# EAGLE design robot (EAGLE 6.3)

## Sheet 1 of 17: PIC32
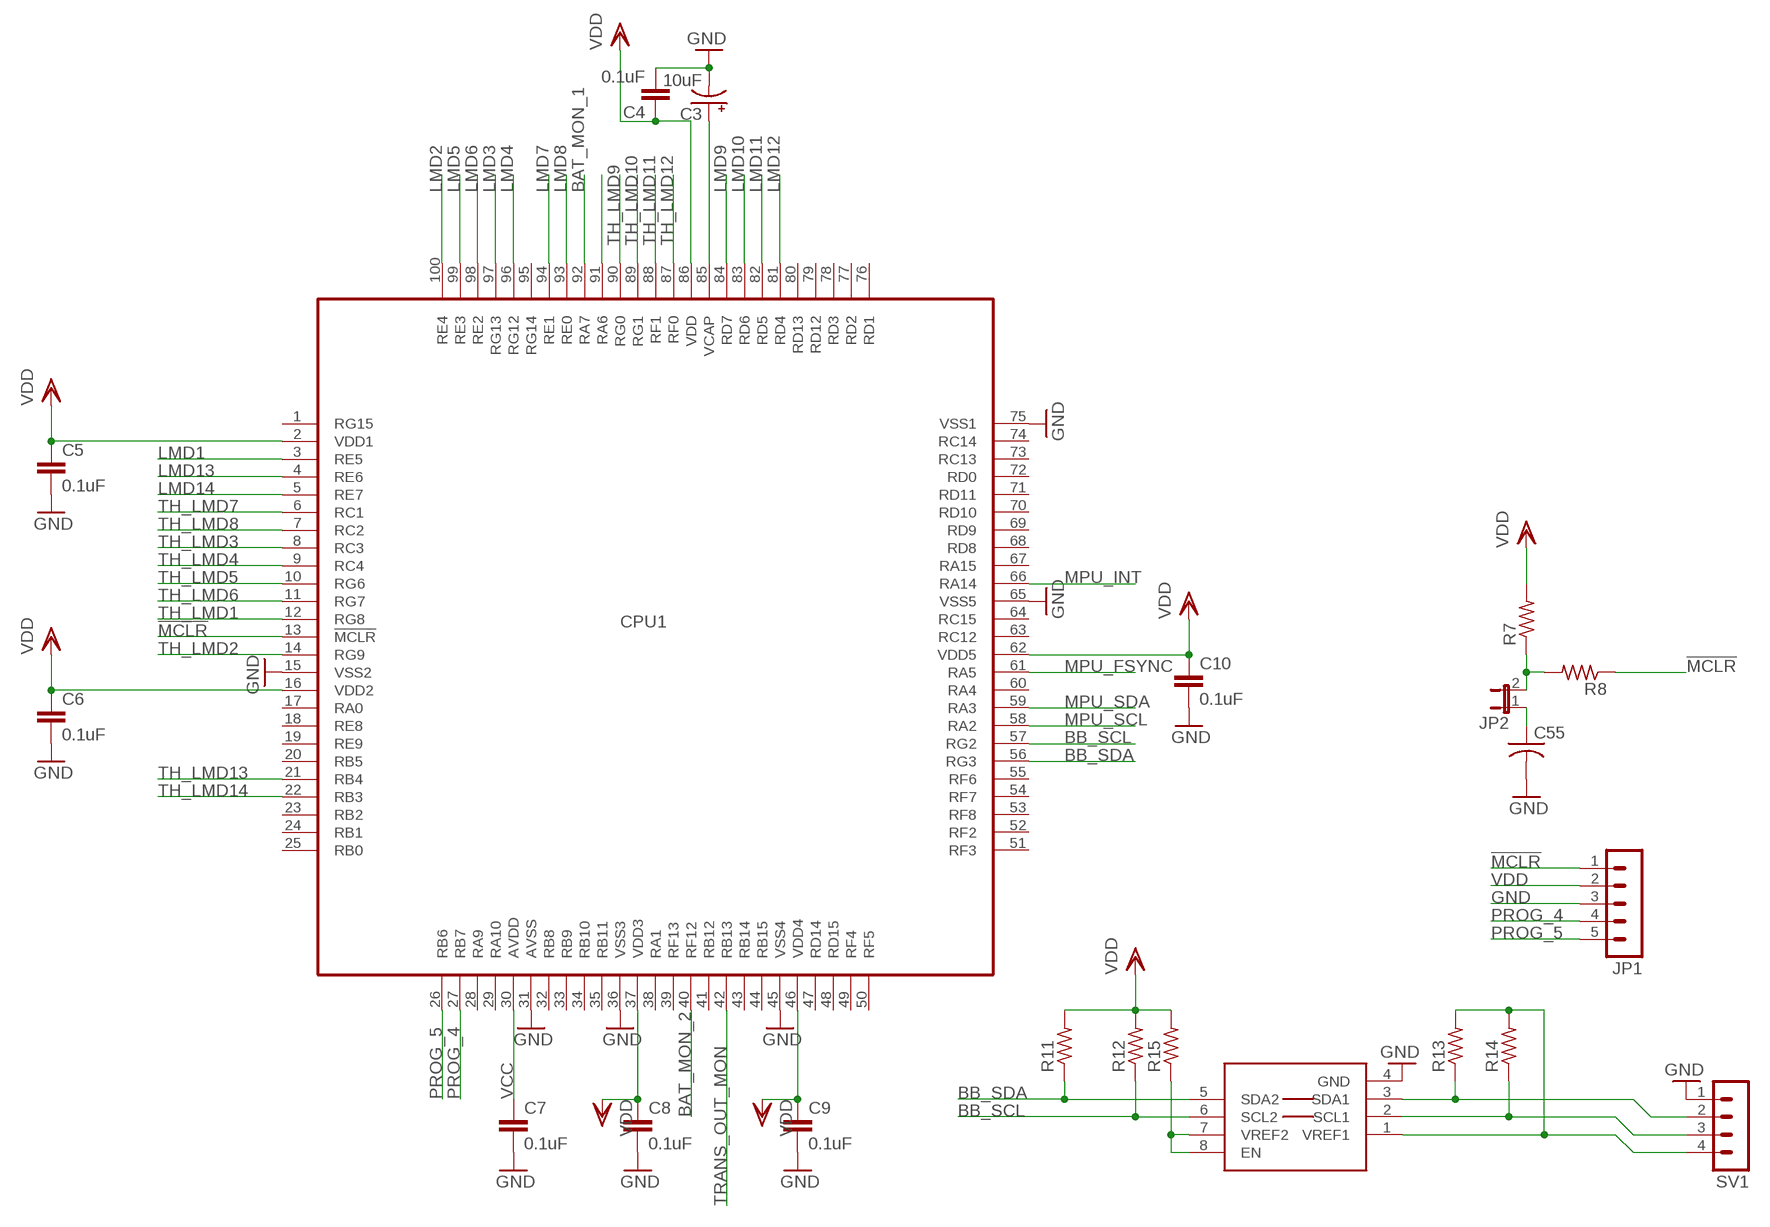
[diagram p0: schematic, sheet 1]

### Parts
C3  10uF  10UF-TANT  [EIA3216]
C4  0.1uF  0.1UF-25V(+80/-20%)(0603)  [0402-CAP]
C5  0.1uF  0.1UF-25V(+80/-20%)(0603)  [0402-CAP]
C6  0.1uF  0.1UF-25V(+80/-20%)(0603)  [0402-CAP]
C7  0.1uF  0.1UF-25V(+80/-20%)(0603)  [0402-CAP]
C8  0.1uF  0.1UF-25V(+80/-20%)(0603)  [0402-CAP]
C9  0.1uF  0.1UF-25V(+80/-20%)(0603)  [0402-CAP]
C10  0.1uF  0.1UF-25V(+80/-20%)(0603)  [0402-CAP]
C55  C-USC0603  [C0603]
CPU1  DSPIC33FJ32GS610TQFP  [TQFP100-14X14]
JP1  MA05-1  [MA05-1]
JP2  JP1E  [JP1]
R7  R-US_R0603  [R0603]
R8  R-US_R0603  [R0603]
R11  R-US_R0603  [R0603]
R12  R-US_R0603  [R0603]
R13  R-US_R0603  [R0603]
R14  R-US_R0603  [R0603]
R15  R-US_R0603  [R0603]
SV1  MA04-1  [MA04-1]
U$17  PCA9306  [PSOP-8]

### Nets
!MCLR: CPU1.13(!MCLR) JP1.1 R8.1
BAT_MON_1: CPU1.92(RA7) ; also sheet 17
BAT_MON_2: CPU1.40(RF12) ; also sheet 17
BB_SCL: CPU1.57(RG2) R12.1 U$17.6(SCL2)
BB_SDA: CPU1.56(RG3) R11.1 U$17.5(SDA2)
GND: C3.C(-) C4.2 C5.2 C6.2 C7.2 C8.2 C9.2 C10.2 C55.2 CPU1.15(VSS2) CPU1.31(AVSS) CPU1.36(VSS3) CPU1.45(VSS4) CPU1.65(VSS5) CPU1.75(VSS1) JP1.3 SV1.1 U$17.4(GND) ; also sheet 2,3,4,5,6,7,8,9,10,11,12,13,14,15,16,17
LMD1: CPU1.3(RE5) ; also sheet 3
LMD2: CPU1.100(RE4) ; also sheet 4
LMD3: CPU1.97(RG13) ; also sheet 5
LMD4: CPU1.96(RG12) ; also sheet 6
LMD5: CPU1.99(RE3) ; also sheet 7
LMD6: CPU1.98(RE2) ; also sheet 8
LMD7: CPU1.94(RE1) ; also sheet 9
LMD8: CPU1.93(RE0) ; also sheet 10
LMD9: CPU1.84(RD7) ; also sheet 11
LMD10: CPU1.83(RD6) ; also sheet 12
LMD11: CPU1.82(RD5) ; also sheet 13
LMD12: CPU1.81(RD4) ; also sheet 14
LMD13: CPU1.4(RE6) ; also sheet 15
LMD14: CPU1.5(RE7) ; also sheet 16
MPU_FSYNC: CPU1.61(RA5) ; also sheet 2
MPU_INT: CPU1.66(RA14) ; also sheet 2
MPU_SCL: CPU1.58(RA2) ; also sheet 2
MPU_SDA: CPU1.59(RA3) ; also sheet 2
N$1: C3.A(+) CPU1.85(VCAP)
N$61: JP2.2 R7.1 R8.2
N$62: C55.1 JP2.1
N$63: R15.1 U$17.7(VREF2) U$17.8(EN)
N$66: R13.1 SV1.2 U$17.3(SDA1)
N$67: R14.1 SV1.3 U$17.2(SCL1)
N$68: R13.2 R14.2 SV1.4 U$17.1(VREF1)
N$78: CPU1.91(RA6)
PROG_4: CPU1.27(RB7) JP1.4
PROG_5: CPU1.26(RB6) JP1.5
TH_LMD1: CPU1.12(RG8) ; also sheet 3
TH_LMD2: CPU1.14(RG9) ; also sheet 4
TH_LMD3: CPU1.8(RC3) ; also sheet 5
TH_LMD4: CPU1.9(RC4) ; also sheet 6
TH_LMD5: CPU1.10(RG6) ; also sheet 7
TH_LMD6: CPU1.11(RG7) ; also sheet 8
TH_LMD7: CPU1.6(RC1) ; also sheet 9
TH_LMD8: CPU1.7(RC2) ; also sheet 10
TH_LMD9: CPU1.90(RG0) ; also sheet 11
TH_LMD10: CPU1.89(RG1) ; also sheet 12
TH_LMD11: CPU1.88(RF1) ; also sheet 13
TH_LMD12: CPU1.87(RF0) ; also sheet 14
TH_LMD13: CPU1.21(RB4) ; also sheet 15
TH_LMD14: CPU1.22(RB3) ; also sheet 16
TRANS_OUT_MON: CPU1.42(RB13) ; also sheet 17
VCC: C7.1 CPU1.30(AVDD) ; also sheet 17
VDD: C4.1 C5.1 C6.1 C8.1 C9.1 C10.1 CPU1.2(VDD1) CPU1.16(VDD2) CPU1.37(VDD3) CPU1.46(VDD4) CPU1.62(VDD5) CPU1.86(VDD) JP1.2 R7.2 R11.2 R12.2 R15.2 ; also sheet 2,3,4,5,6,7,8,9,10,11,12,13,14,15,16,17
Unconnected: CPU1.1(RG15) CPU1.17(RA0) CPU1.18(RE8) CPU1.19(RE9) CPU1.20(RB5) CPU1.23(RB2) CPU1.24(RB1) CPU1.25(RB0) CPU1.28(RA9) CPU1.29(RA10) CPU1.32(RB8) CPU1.33(RB9) CPU1.34(RB10) CPU1.35(RB11) CPU1.38(RA1) CPU1.39(RF13) CPU1.41(RB12) CPU1.43(RB14) CPU1.44(RB15) CPU1.47(RD14) CPU1.48(RD15) CPU1.49(RF4) CPU1.50(RF5) CPU1.51(RF3) CPU1.52(RF2) CPU1.53(RF8) CPU1.54(RF7) CPU1.55(RF6) CPU1.60(RA4) CPU1.63(RC12) CPU1.64(RC15) CPU1.67(RA15) CPU1.68(RD8) CPU1.69(RD9) CPU1.70(RD10) CPU1.71(RD11) CPU1.72(RD0) CPU1.73(RC13) CPU1.74(RC14) CPU1.76(RD1) CPU1.77(RD2) CPU1.78(RD3) CPU1.79(RD12) CPU1.80(RD13) CPU1.95(RG14)

## Sheet 2 of 17: MPU
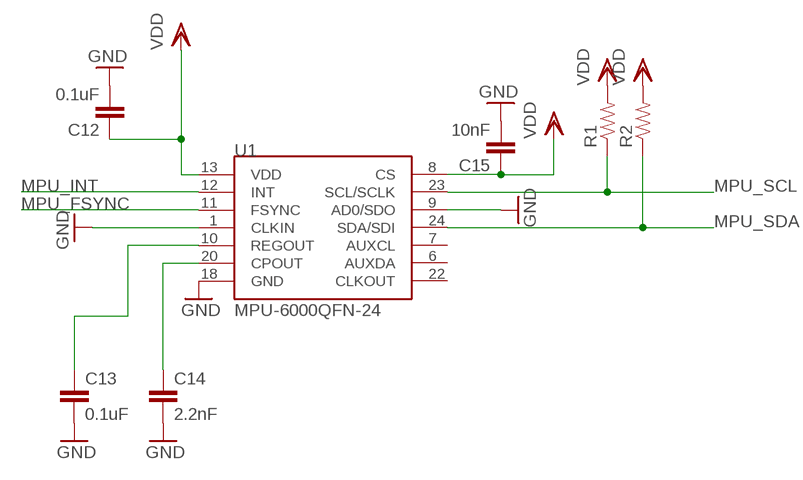
[diagram p1: schematic, sheet 2]

### Parts
C12  0.1uF  0.1UF-25V(+80/-20%)(0603)  [0402-CAP]
C13  0.1uF  0.1UF-25V(+80/-20%)(0603)  [0402-CAP]
C14  2.2nF  10NF-CER  [0402-CAP]
C15  10nF  10NF-CER  [0402-CAP]
R1  RESISTOR0603-RES  [0603-RES]
R2  RESISTOR0603-RES  [0603-RES]
U1  MPU-6000QFN-24  [QFN-24-TESTING]

### Nets
GND: C12.2 C13.2 C14.2 C15.2 U1.1(CLKIN) U1.9(AD0/SDO) U1.18(GND) ; also sheet 1,3,4,5,6,7,8,9,10,11,12,13,14,15,16,17
MPU_FSYNC: U1.11(FSYNC) ; also sheet 1
MPU_INT: U1.12(INT) ; also sheet 1
MPU_SCL: R1.1 U1.23(SCL/SCLK) ; also sheet 1
MPU_SDA: R2.1 U1.24(SDA/SDI) ; also sheet 1
N$8: C14.1 U1.20(CPOUT)
N$9: C13.1 U1.10(REGOUT)
VDD: C12.1 C15.1 R1.2 R2.2 U1.8(CS) U1.13(VDD) ; also sheet 1,3,4,5,6,7,8,9,10,11,12,13,14,15,16,17
Unconnected: U1.6(AUXDA) U1.7(AUXCL) U1.22(CLKOUT)

## Sheet 3 of 17: LMD1
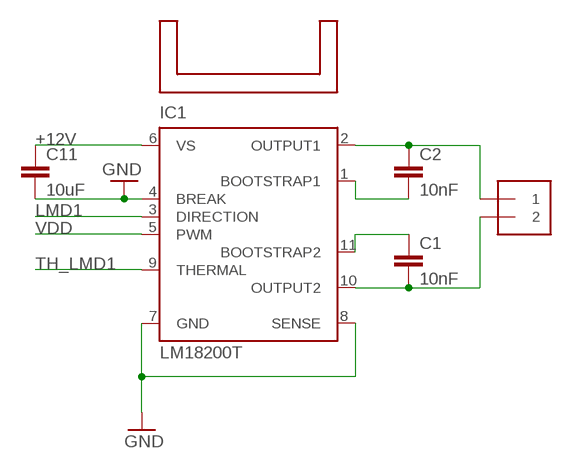
[diagram p2: schematic, sheet 3]

### Parts
C1  10nF  10NF-CER  [0402-CAP]
C2  10nF  10NF-CER  [0402-CAP]
C11  10uF  10UF-6.3V-20%(1206)  [1206]
IC1  LM18200T  [TO-220-11]
J13  1X2-3.5MM  [1X2-3.5MM]
U$3  593002B03400G  [593002B03400G]

### Nets
+12V: C11.1 IC1.6(VS) ; also sheet 4,5,6,7,8,9,10,11,12,13,14,15,16,17
GND: C11.2 IC1.4(BREAK) IC1.7(GND) IC1.8(SENSE) ; also sheet 1,2,4,5,6,7,8,9,10,11,12,13,14,15,16,17
LMD1: IC1.3(DIRECTION) ; also sheet 1
N$3: C2.1 IC1.2(OUTPUT1) J13.1
N$4: C2.2 IC1.1(BOOTSTRAP1)
N$5: C1.1 IC1.11(BOOTSTRAP2)
N$6: C1.2 IC1.10(OUTPUT2) J13.2
TH_LMD1: IC1.9(THERMAL) ; also sheet 1
VDD: IC1.5(PWM) ; also sheet 1,2,4,5,6,7,8,9,10,11,12,13,14,15,16,17

## Sheet 4 of 17: LMD2
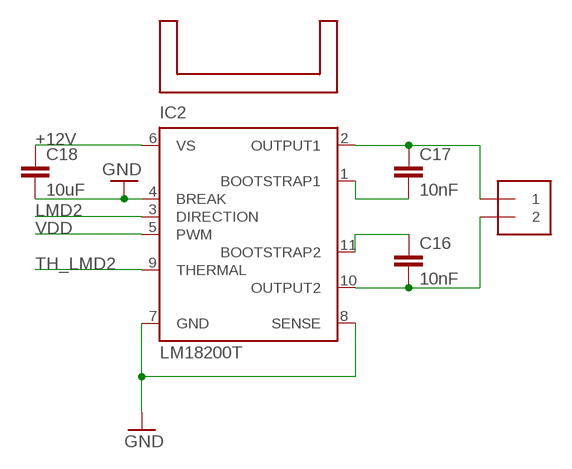
[diagram p3: schematic, sheet 4]

### Parts
C16  10nF  10NF-CER  [0402-CAP]
C17  10nF  10NF-CER  [0402-CAP]
C18  10uF  10UF-6.3V-20%(1206)  [1206]
IC2  LM18200T  [TO-220-11]
J2  1X2-3.5MM  [1X2-3.5MM]
U$4  593002B03400G  [593002B03400G]

### Nets
+12V: C18.1 IC2.6(VS) ; also sheet 3,5,6,7,8,9,10,11,12,13,14,15,16,17
GND: C18.2 IC2.4(BREAK) IC2.7(GND) IC2.8(SENSE) ; also sheet 1,2,3,5,6,7,8,9,10,11,12,13,14,15,16,17
LMD2: IC2.3(DIRECTION) ; also sheet 1
N$11: C17.1 IC2.2(OUTPUT1) J2.1
N$12: C17.2 IC2.1(BOOTSTRAP1)
N$13: C16.1 IC2.11(BOOTSTRAP2)
N$14: C16.2 IC2.10(OUTPUT2) J2.2
TH_LMD2: IC2.9(THERMAL) ; also sheet 1
VDD: IC2.5(PWM) ; also sheet 1,2,3,5,6,7,8,9,10,11,12,13,14,15,16,17

## Sheet 5 of 17: LMD3
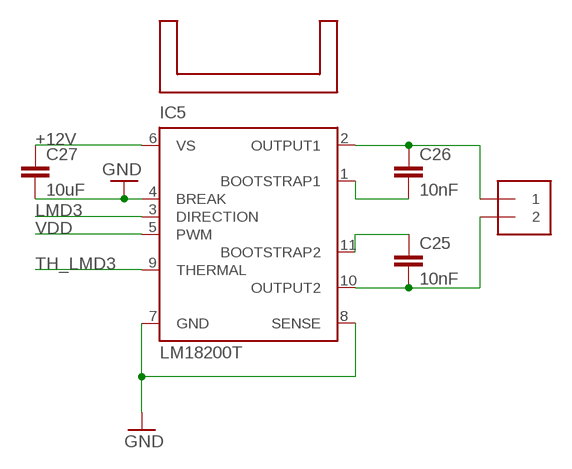
[diagram p4: schematic, sheet 5]

### Parts
C25  10nF  10NF-CER  [0402-CAP]
C26  10nF  10NF-CER  [0402-CAP]
C27  10uF  10UF-6.3V-20%(1206)  [1206]
IC5  LM18200T  [TO-220-11]
J5  1X2-3.5MM  [1X2-3.5MM]
U$5  593002B03400G  [593002B03400G]

### Nets
+12V: C27.1 IC5.6(VS) ; also sheet 3,4,6,7,8,9,10,11,12,13,14,15,16,17
GND: C27.2 IC5.4(BREAK) IC5.7(GND) IC5.8(SENSE) ; also sheet 1,2,3,4,6,7,8,9,10,11,12,13,14,15,16,17
LMD3: IC5.3(DIRECTION) ; also sheet 1
N$23: C26.1 IC5.2(OUTPUT1) J5.1
N$24: C26.2 IC5.1(BOOTSTRAP1)
N$25: C25.1 IC5.11(BOOTSTRAP2)
N$26: C25.2 IC5.10(OUTPUT2) J5.2
TH_LMD3: IC5.9(THERMAL) ; also sheet 1
VDD: IC5.5(PWM) ; also sheet 1,2,3,4,6,7,8,9,10,11,12,13,14,15,16,17

## Sheet 6 of 17: LMD4
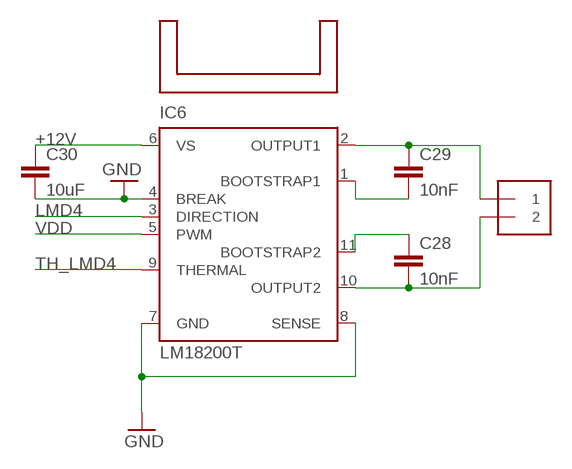
[diagram p5: schematic, sheet 6]

### Parts
C28  10nF  10NF-CER  [0402-CAP]
C29  10nF  10NF-CER  [0402-CAP]
C30  10uF  10UF-6.3V-20%(1206)  [1206]
IC6  LM18200T  [TO-220-11]
J6  1X2-3.5MM  [1X2-3.5MM]
U$6  593002B03400G  [593002B03400G]

### Nets
+12V: C30.1 IC6.6(VS) ; also sheet 3,4,5,7,8,9,10,11,12,13,14,15,16,17
GND: C30.2 IC6.4(BREAK) IC6.7(GND) IC6.8(SENSE) ; also sheet 1,2,3,4,5,7,8,9,10,11,12,13,14,15,16,17
LMD4: IC6.3(DIRECTION) ; also sheet 1
N$27: C29.1 IC6.2(OUTPUT1) J6.1
N$28: C29.2 IC6.1(BOOTSTRAP1)
N$29: C28.1 IC6.11(BOOTSTRAP2)
N$30: C28.2 IC6.10(OUTPUT2) J6.2
TH_LMD4: IC6.9(THERMAL) ; also sheet 1
VDD: IC6.5(PWM) ; also sheet 1,2,3,4,5,7,8,9,10,11,12,13,14,15,16,17

## Sheet 7 of 17: LMD5
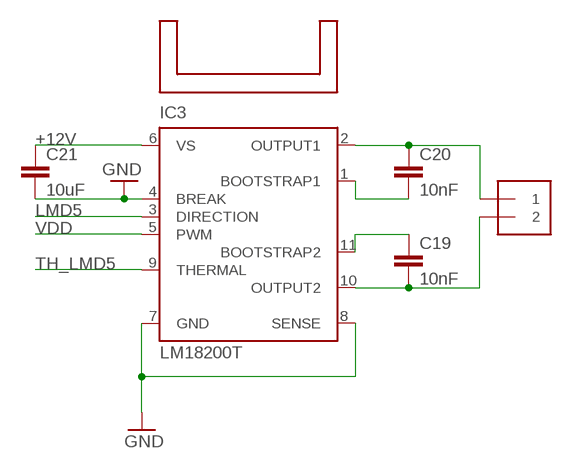
[diagram p6: schematic, sheet 7]

### Parts
C19  10nF  10NF-CER  [0402-CAP]
C20  10nF  10NF-CER  [0402-CAP]
C21  10uF  10UF-6.3V-20%(1206)  [1206]
IC3  LM18200T  [TO-220-11]
J3  1X2-3.5MM  [1X2-3.5MM]
U$7  593002B03400G  [593002B03400G]

### Nets
+12V: C21.1 IC3.6(VS) ; also sheet 3,4,5,6,8,9,10,11,12,13,14,15,16,17
GND: C21.2 IC3.4(BREAK) IC3.7(GND) IC3.8(SENSE) ; also sheet 1,2,3,4,5,6,8,9,10,11,12,13,14,15,16,17
LMD5: IC3.3(DIRECTION) ; also sheet 1
N$15: C20.1 IC3.2(OUTPUT1) J3.1
N$16: C20.2 IC3.1(BOOTSTRAP1)
N$17: C19.1 IC3.11(BOOTSTRAP2)
N$18: C19.2 IC3.10(OUTPUT2) J3.2
TH_LMD5: IC3.9(THERMAL) ; also sheet 1
VDD: IC3.5(PWM) ; also sheet 1,2,3,4,5,6,8,9,10,11,12,13,14,15,16,17

## Sheet 8 of 17: LMD6
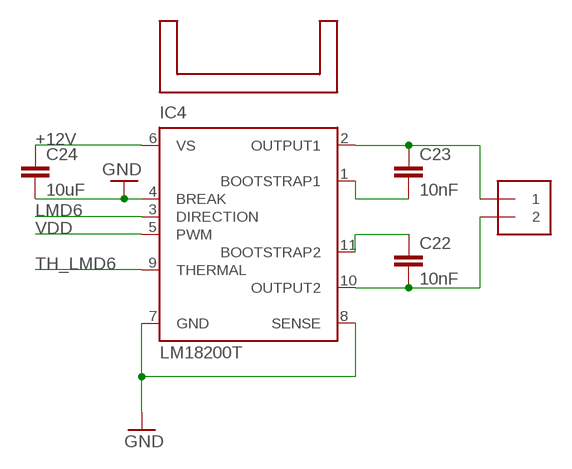
[diagram p7: schematic, sheet 8]

### Parts
C22  10nF  10NF-CER  [0402-CAP]
C23  10nF  10NF-CER  [0402-CAP]
C24  10uF  10UF-6.3V-20%(1206)  [1206]
IC4  LM18200T  [TO-220-11]
J4  1X2-3.5MM  [1X2-3.5MM]
U$8  593002B03400G  [593002B03400G]

### Nets
+12V: C24.1 IC4.6(VS) ; also sheet 3,4,5,6,7,9,10,11,12,13,14,15,16,17
GND: C24.2 IC4.4(BREAK) IC4.7(GND) IC4.8(SENSE) ; also sheet 1,2,3,4,5,6,7,9,10,11,12,13,14,15,16,17
LMD6: IC4.3(DIRECTION) ; also sheet 1
N$19: C23.1 IC4.2(OUTPUT1) J4.1
N$20: C23.2 IC4.1(BOOTSTRAP1)
N$21: C22.1 IC4.11(BOOTSTRAP2)
N$22: C22.2 IC4.10(OUTPUT2) J4.2
TH_LMD6: IC4.9(THERMAL) ; also sheet 1
VDD: IC4.5(PWM) ; also sheet 1,2,3,4,5,6,7,9,10,11,12,13,14,15,16,17

## Sheet 9 of 17: LMD7
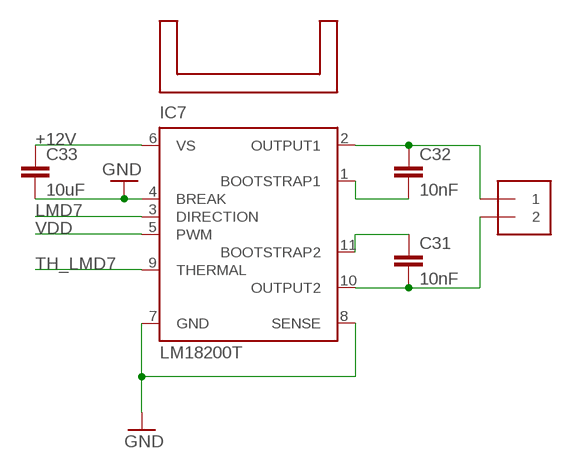
[diagram p8: schematic, sheet 9]

### Parts
C31  10nF  10NF-CER  [0402-CAP]
C32  10nF  10NF-CER  [0402-CAP]
C33  10uF  10UF-6.3V-20%(1206)  [1206]
IC7  LM18200T  [TO-220-11]
J7  1X2-3.5MM  [1X2-3.5MM]
U$9  593002B03400G  [593002B03400G]

### Nets
+12V: C33.1 IC7.6(VS) ; also sheet 3,4,5,6,7,8,10,11,12,13,14,15,16,17
GND: C33.2 IC7.4(BREAK) IC7.7(GND) IC7.8(SENSE) ; also sheet 1,2,3,4,5,6,7,8,10,11,12,13,14,15,16,17
LMD7: IC7.3(DIRECTION) ; also sheet 1
N$31: C32.1 IC7.2(OUTPUT1) J7.1
N$32: C32.2 IC7.1(BOOTSTRAP1)
N$33: C31.1 IC7.11(BOOTSTRAP2)
N$34: C31.2 IC7.10(OUTPUT2) J7.2
TH_LMD7: IC7.9(THERMAL) ; also sheet 1
VDD: IC7.5(PWM) ; also sheet 1,2,3,4,5,6,7,8,10,11,12,13,14,15,16,17

## Sheet 10 of 17: LMD8
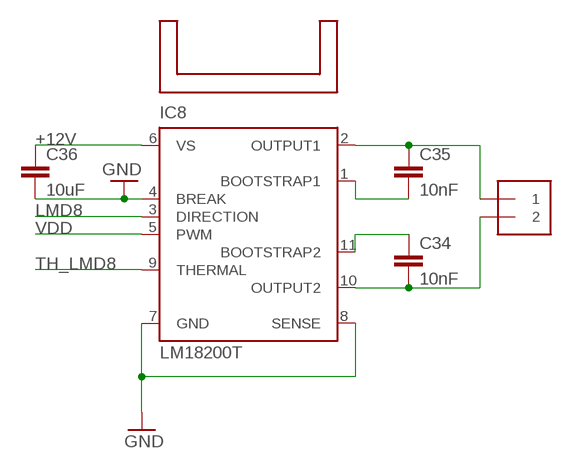
[diagram p9: schematic, sheet 10]

### Parts
C34  10nF  10NF-CER  [0402-CAP]
C35  10nF  10NF-CER  [0402-CAP]
C36  10uF  10UF-6.3V-20%(1206)  [1206]
IC8  LM18200T  [TO-220-11]
J8  1X2-3.5MM  [1X2-3.5MM]
U$10  593002B03400G  [593002B03400G]

### Nets
+12V: C36.1 IC8.6(VS) ; also sheet 3,4,5,6,7,8,9,11,12,13,14,15,16,17
GND: C36.2 IC8.4(BREAK) IC8.7(GND) IC8.8(SENSE) ; also sheet 1,2,3,4,5,6,7,8,9,11,12,13,14,15,16,17
LMD8: IC8.3(DIRECTION) ; also sheet 1
N$35: C35.1 IC8.2(OUTPUT1) J8.1
N$36: C35.2 IC8.1(BOOTSTRAP1)
N$37: C34.1 IC8.11(BOOTSTRAP2)
N$38: C34.2 IC8.10(OUTPUT2) J8.2
TH_LMD8: IC8.9(THERMAL) ; also sheet 1
VDD: IC8.5(PWM) ; also sheet 1,2,3,4,5,6,7,8,9,11,12,13,14,15,16,17

## Sheet 11 of 17: LMD9
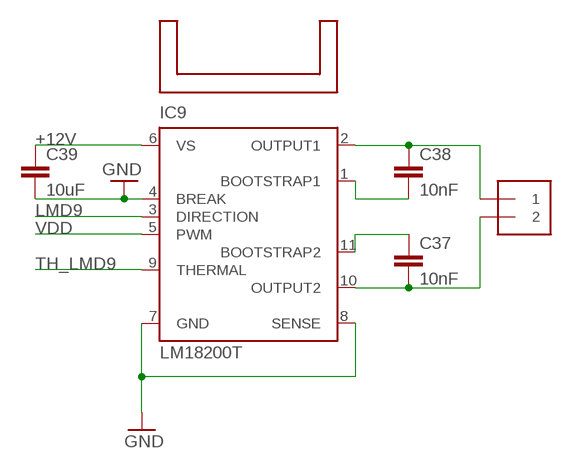
[diagram p10: schematic, sheet 11]

### Parts
C37  10nF  10NF-CER  [0402-CAP]
C38  10nF  10NF-CER  [0402-CAP]
C39  10uF  10UF-6.3V-20%(1206)  [1206]
IC9  LM18200T  [TO-220-11]
J9  1X2-3.5MM  [1X2-3.5MM]
U$11  593002B03400G  [593002B03400G]

### Nets
+12V: C39.1 IC9.6(VS) ; also sheet 3,4,5,6,7,8,9,10,12,13,14,15,16,17
GND: C39.2 IC9.4(BREAK) IC9.7(GND) IC9.8(SENSE) ; also sheet 1,2,3,4,5,6,7,8,9,10,12,13,14,15,16,17
LMD9: IC9.3(DIRECTION) ; also sheet 1
N$39: C38.1 IC9.2(OUTPUT1) J9.1
N$40: C38.2 IC9.1(BOOTSTRAP1)
N$41: C37.1 IC9.11(BOOTSTRAP2)
N$42: C37.2 IC9.10(OUTPUT2) J9.2
TH_LMD9: IC9.9(THERMAL) ; also sheet 1
VDD: IC9.5(PWM) ; also sheet 1,2,3,4,5,6,7,8,9,10,12,13,14,15,16,17

## Sheet 12 of 17: LMD10
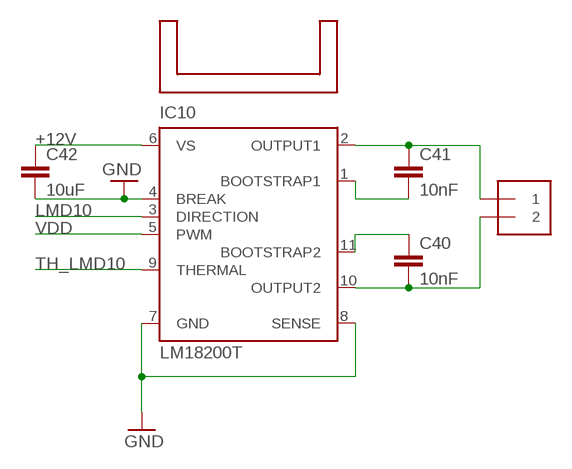
[diagram p11: schematic, sheet 12]

### Parts
C40  10nF  10NF-CER  [0402-CAP]
C41  10nF  10NF-CER  [0402-CAP]
C42  10uF  10UF-6.3V-20%(1206)  [1206]
IC10  LM18200T  [TO-220-11]
J10  1X2-3.5MM  [1X2-3.5MM]
U$12  593002B03400G  [593002B03400G]

### Nets
+12V: C42.1 IC10.6(VS) ; also sheet 3,4,5,6,7,8,9,10,11,13,14,15,16,17
GND: C42.2 IC10.4(BREAK) IC10.7(GND) IC10.8(SENSE) ; also sheet 1,2,3,4,5,6,7,8,9,10,11,13,14,15,16,17
LMD10: IC10.3(DIRECTION) ; also sheet 1
N$43: C41.1 IC10.2(OUTPUT1) J10.1
N$44: C41.2 IC10.1(BOOTSTRAP1)
N$45: C40.1 IC10.11(BOOTSTRAP2)
N$46: C40.2 IC10.10(OUTPUT2) J10.2
TH_LMD10: IC10.9(THERMAL) ; also sheet 1
VDD: IC10.5(PWM) ; also sheet 1,2,3,4,5,6,7,8,9,10,11,13,14,15,16,17

## Sheet 13 of 17: LMD11
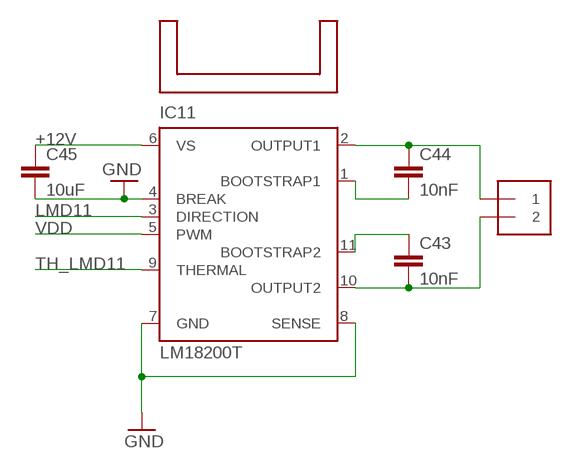
[diagram p12: schematic, sheet 13]

### Parts
C43  10nF  10NF-CER  [0402-CAP]
C44  10nF  10NF-CER  [0402-CAP]
C45  10uF  10UF-6.3V-20%(1206)  [1206]
IC11  LM18200T  [TO-220-11]
J11  1X2-3.5MM  [1X2-3.5MM]
U$13  593002B03400G  [593002B03400G]

### Nets
+12V: C45.1 IC11.6(VS) ; also sheet 3,4,5,6,7,8,9,10,11,12,14,15,16,17
GND: C45.2 IC11.4(BREAK) IC11.7(GND) IC11.8(SENSE) ; also sheet 1,2,3,4,5,6,7,8,9,10,11,12,14,15,16,17
LMD11: IC11.3(DIRECTION) ; also sheet 1
N$47: C44.1 IC11.2(OUTPUT1) J11.1
N$48: C44.2 IC11.1(BOOTSTRAP1)
N$49: C43.1 IC11.11(BOOTSTRAP2)
N$50: C43.2 IC11.10(OUTPUT2) J11.2
TH_LMD11: IC11.9(THERMAL) ; also sheet 1
VDD: IC11.5(PWM) ; also sheet 1,2,3,4,5,6,7,8,9,10,11,12,14,15,16,17

## Sheet 14 of 17: LMD12
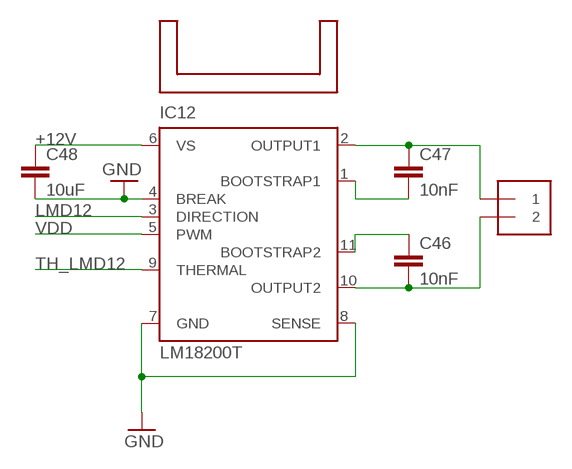
[diagram p13: schematic, sheet 14]

### Parts
C46  10nF  10NF-CER  [0402-CAP]
C47  10nF  10NF-CER  [0402-CAP]
C48  10uF  10UF-6.3V-20%(1206)  [1206]
IC12  LM18200T  [TO-220-11]
J14  1X2-3.5MM  [1X2-3.5MM]
U$14  593002B03400G  [593002B03400G]

### Nets
+12V: C48.1 IC12.6(VS) ; also sheet 3,4,5,6,7,8,9,10,11,12,13,15,16,17
GND: C48.2 IC12.4(BREAK) IC12.7(GND) IC12.8(SENSE) ; also sheet 1,2,3,4,5,6,7,8,9,10,11,12,13,15,16,17
LMD12: IC12.3(DIRECTION) ; also sheet 1
N$51: C47.1 IC12.2(OUTPUT1) J14.1
N$52: C47.2 IC12.1(BOOTSTRAP1)
N$53: C46.1 IC12.11(BOOTSTRAP2)
N$54: C46.2 IC12.10(OUTPUT2) J14.2
TH_LMD12: IC12.9(THERMAL) ; also sheet 1
VDD: IC12.5(PWM) ; also sheet 1,2,3,4,5,6,7,8,9,10,11,12,13,15,16,17

## Sheet 15 of 17: LMD13
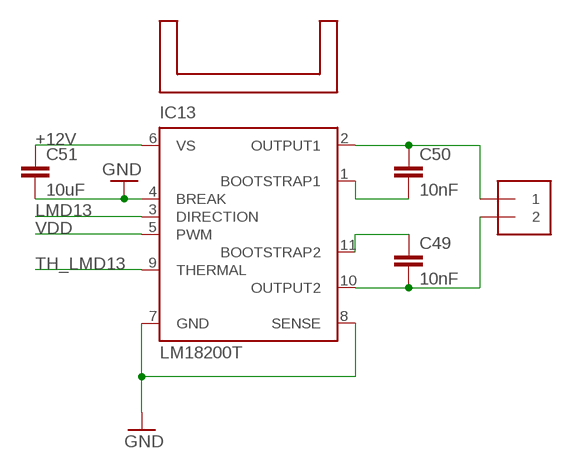
[diagram p14: schematic, sheet 15]

### Parts
C49  10nF  10NF-CER  [0402-CAP]
C50  10nF  10NF-CER  [0402-CAP]
C51  10uF  10UF-6.3V-20%(1206)  [1206]
IC13  LM18200T  [TO-220-11]
J15  1X2-3.5MM  [1X2-3.5MM]
U$15  593002B03400G  [593002B03400G]

### Nets
+12V: C51.1 IC13.6(VS) ; also sheet 3,4,5,6,7,8,9,10,11,12,13,14,16,17
GND: C51.2 IC13.4(BREAK) IC13.7(GND) IC13.8(SENSE) ; also sheet 1,2,3,4,5,6,7,8,9,10,11,12,13,14,16,17
LMD13: IC13.3(DIRECTION) ; also sheet 1
N$2: C50.1 IC13.2(OUTPUT1) J15.1
N$7: C50.2 IC13.1(BOOTSTRAP1)
N$55: C49.1 IC13.11(BOOTSTRAP2)
N$56: C49.2 IC13.10(OUTPUT2) J15.2
TH_LMD13: IC13.9(THERMAL) ; also sheet 1
VDD: IC13.5(PWM) ; also sheet 1,2,3,4,5,6,7,8,9,10,11,12,13,14,16,17

## Sheet 16 of 17: LMD14
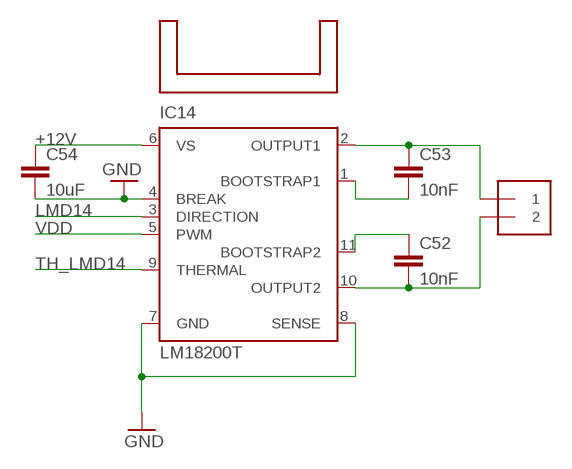
[diagram p15: schematic, sheet 16]

### Parts
C52  10nF  10NF-CER  [0402-CAP]
C53  10nF  10NF-CER  [0402-CAP]
C54  10uF  10UF-6.3V-20%(1206)  [1206]
IC14  LM18200T  [TO-220-11]
J16  1X2-3.5MM  [1X2-3.5MM]
U$16  593002B03400G  [593002B03400G]

### Nets
+12V: C54.1 IC14.6(VS) ; also sheet 3,4,5,6,7,8,9,10,11,12,13,14,15,17
GND: C54.2 IC14.4(BREAK) IC14.7(GND) IC14.8(SENSE) ; also sheet 1,2,3,4,5,6,7,8,9,10,11,12,13,14,15,17
LMD14: IC14.3(DIRECTION) ; also sheet 1
N$57: C53.1 IC14.2(OUTPUT1) J16.1
N$58: C53.2 IC14.1(BOOTSTRAP1)
N$59: C52.1 IC14.11(BOOTSTRAP2)
N$60: C52.2 IC14.10(OUTPUT2) J16.2
TH_LMD14: IC14.9(THERMAL) ; also sheet 1
VDD: IC14.5(PWM) ; also sheet 1,2,3,4,5,6,7,8,9,10,11,12,13,14,15,17

## Sheet 17 of 17: Power & Battery Monitor
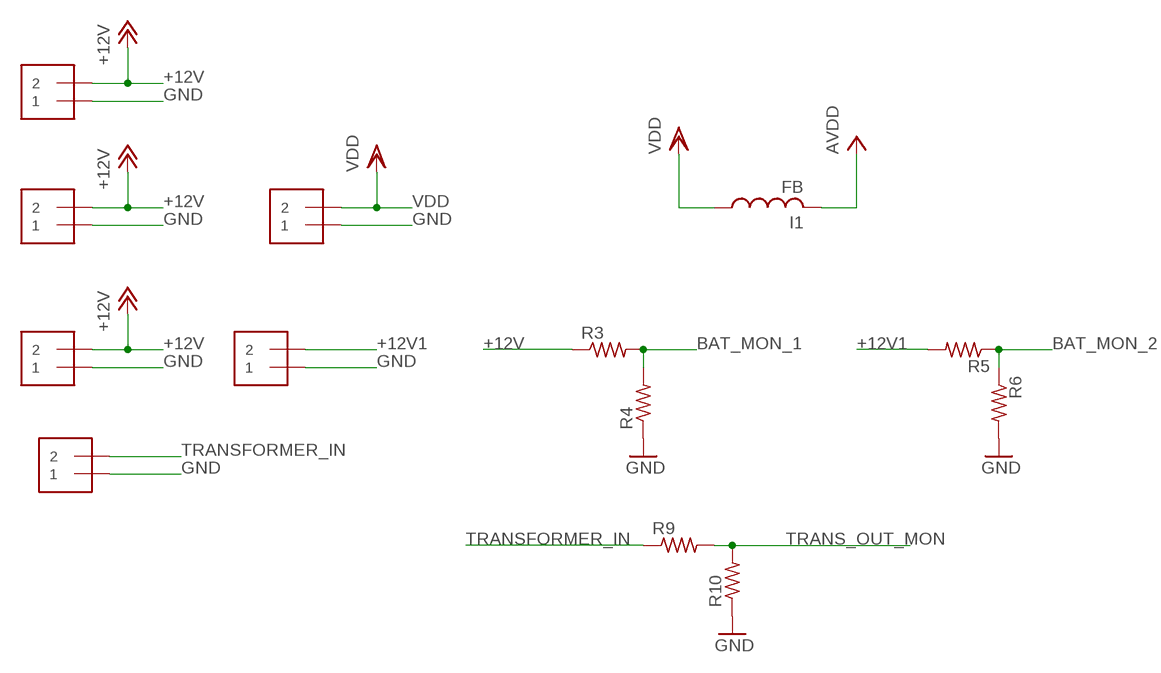
[diagram p16: schematic, sheet 17]

### Parts
I1  FB  [FB]
J1  1X2-3.5MM  [1X2-3.5MM]
J12  1X2-3.5MM  [1X2-3.5MM]
J17  1X2-3.5MM  [1X2-3.5MM]
J18  1X2-3.5MM  [1X2-3.5MM]
J19  1X2-3.5MM  [1X2-3.5MM]
J20  1X2-3.5MM  [1X2-3.5MM]
R3  R-US_R0603  [R0603]
R4  R-US_R0603  [R0603]
R5  R-US_R0603  [R0603]
R6  R-US_R0603  [R0603]
R9  R-US_R0603  [R0603]
R10  R-US_R0603  [R0603]

### Nets
+12V: J12.2 J17.2 J20.2 R3.1 ; also sheet 3,4,5,6,7,8,9,10,11,12,13,14,15,16
+12V1: J18.2 R5.2
BAT_MON_1: R3.2 R4.2 ; also sheet 1
BAT_MON_2: R5.1 R6.1 ; also sheet 1
GND: J1.1 J12.1 J17.1 J18.1 J19.1 J20.1 R4.1 R6.2 R10.1 ; also sheet 1,2,3,4,5,6,7,8,9,10,11,12,13,14,15,16
TRANS_OUT_MON: R9.2 R10.2 ; also sheet 1
TRANSFORMER_IN: J19.2 R9.1
VCC: I1.P$2 ; supply symbol labelled AVDD ; also sheet 1
VDD: I1.P$1 J1.2 ; also sheet 1,2,3,4,5,6,7,8,9,10,11,12,13,14,15,16

## Library data of the parts
C1 C2 C15-C17 C19 C20 C22 C23 C25 C26 C28 C29 C31 C32 C34 C35 C37 C38 C40 C41 C43 C44 C46 C47 C49 C50 C52 C53 = SparkFun-Capacitors:10NF-CER: 10nF/.01uF/10000pF ceramic SMT CAP-00867- 50V 10% (0603); PROD_ID: CAP-00867
C3 = SparkFun-Capacitors:10UF-TANT: 10uF Tantalum SMT CAP-00811- 16V 10% (EIA-3216); PROD_ID: CAP-00811
C4-C10 C12 C13 = SparkFun-Capacitors:0.1UF-25V(+80/-20%)(0603): Ceramic Standard decoupling cap CAP-00810; PROD_ID: CAP-00810
C11 C18 C21 C24 C27 C30 C33 C36 C39 C42 C45 C48 C51 C54 = SparkFun-Capacitors:10UF-6.3V-20%(1206): Ceramic CAP-10057; PROD_ID: CAP-10057
C14 = SparkFun-Capacitors:10NF-CER: 10nF/.01uF/10000pF ceramic SMT CAP-00867- 50V 10% (0603); PROD_ID: CAP-00867; VALUE: 10nF
C55 = adafruit:C-US: CAPACITOR, American symbol
CPU1 = microchip:DSPIC33FJ32GS610
I1 = adafruit:FB: Ferrite bead Digikey #P9821BK-ND
IC1-IC14 = national-semiconductor:LM18200T: 3A, 55V H-Bridge Motor Control SourcE: http://cache.national.com/ds/LM/LMD18200.pdf; OC_FARNELL: unknown; OC_NEWARK: unknown
J1-J20 = adafruit:1X2: 3.5mm Terminal block http://www.ladyada.net/library/pcb/eaglelibrary.html
JP1 = con-lstb:MA05-1: PIN HEADER; OC_FARNELL: unknown; OC_NEWARK: unknown
JP2 = jumper:JP1E: JUMPER
R1 R2 = SparkFun-Passives:RESISTOR: Resistor Basic schematic elements and footprints for 0603, 1206, and PTH resistors.
R3-R15 = adafruit:R-US_: RESISTOR, American symbol
SV1 = con-lstb:MA04-1: PIN HEADER; OC_FARNELL: unknown; OC_NEWARK: unknown
U1 = SparkFun-Sensors:MPU-6000: MPU-6000 - I2C address is 0x68 with AD0 low and 0x69 with AD0 high.
U$3-U$16 = aavid:593002B03400G
U$17 = SparkFun-DigitalIC:PCA9306: Bidirectional I2C level shifter. NOT compatible with all available part number pinout schemes- DOUBLE CHECK!!!

## Board
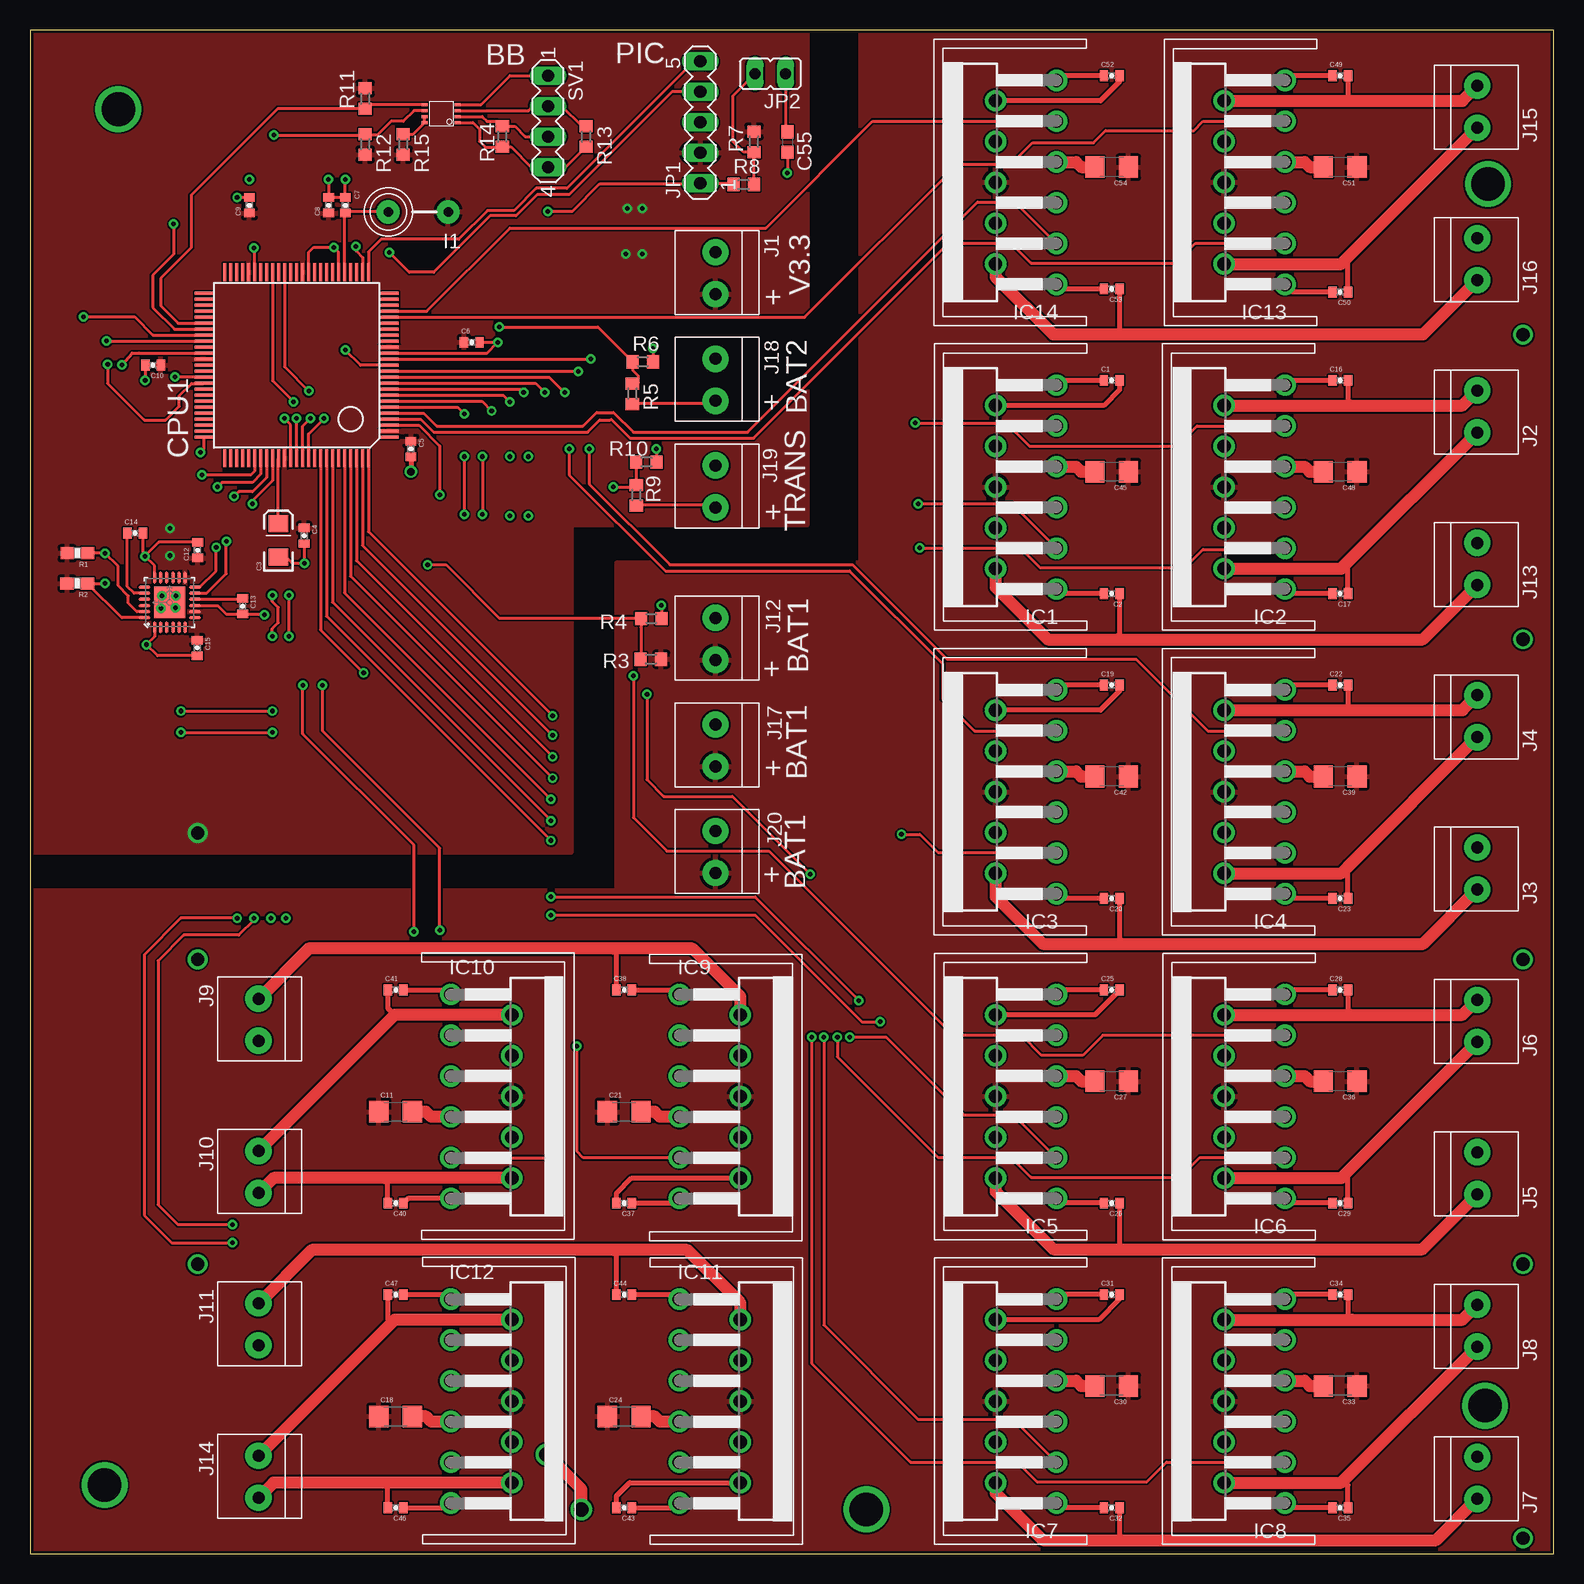
[diagram p17: board, top side]
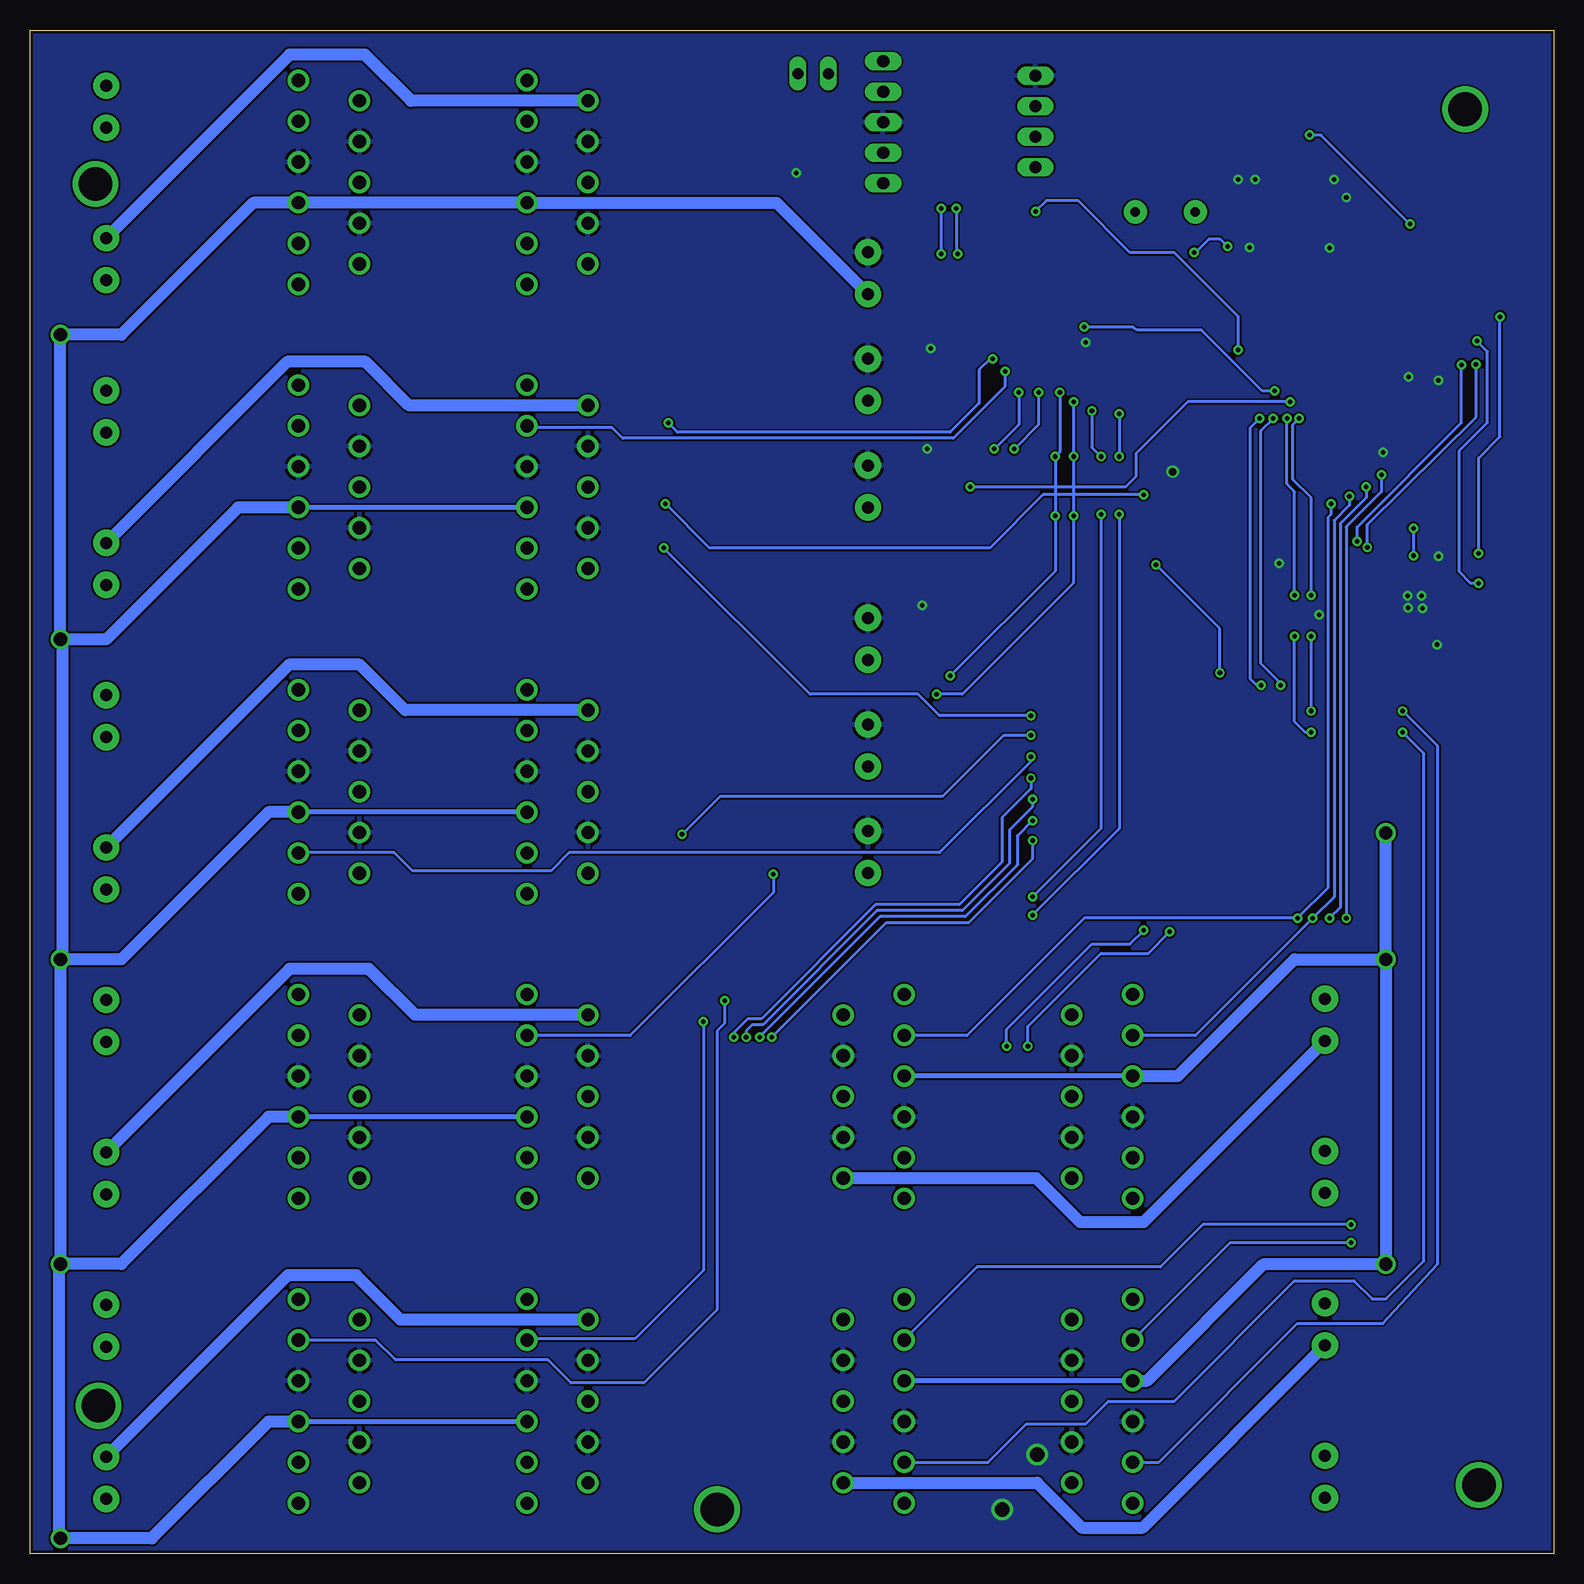
[diagram p18: board, bottom side, seen from below]

Size 127 x 127 mm. Coordinates in mm from the lower left corner, seen from the top.
Outline: 0,0 127,0 127,127 0,127 0,0
Copper layers (1*16): Top 0.035mm / dielectric 1.5mm / Bottom 0.035mm
Design rules "4pcb *": minimum track width 10mil, minimum drill 15mil, track to track 6mil, track to pad 6mil, pad to pad 6mil, via to via 6mil, smd to smd 6mil, copper to edge 10mil, drill to drill 6mil, minimum pad ring 10mil, minimum via ring 8mil, stop-mask expansion 4mil, vias tented up to drill 0mil, thermal gap 10mil

### Footprints (pad centres in the part's own frame; a part is rotated, then mirrored left to right if it is on the bottom)
0402-CAP = smd 0.7 x 0.9: 1 -0.65,0; 2 0.65,0
EIA3216 = smd 1.4 x 1.6: A 1.4,0; C -1.4,0
1206 = smd 1.6 x 1.8: 1 -1.4,0; 2 1.4,0
C0603 = smd 1.1 x 1: 1 -0.85,0; 2 0.85,0
TQFP100-14X14 = smd 0.27 x 1.5: 1 -6,-7.75; 2 -5.5,-7.75; 3 -5,-7.75; 4 -4.5,-7.75; 5 -4,-7.75; 6 -3.5,-7.75; 7 -3,-7.75; 8 -2.5,-7.75; 9 -2,-7.75; 10 -1.5,-7.75; 11 -1,-7.75; 12 -0.5,-7.75; 13 0,-7.75; 14 0.5,-7.75; 15 1,-7.75; 16 1.5,-7.75; 17 2,-7.75; 18 2.5,-7.75; 19 3,-7.75; 20 3.5,-7.75; 21 4,-7.75; 22 4.5,-7.75; 23 5,-7.75; 24 5.5,-7.75; 25 6,-7.75; 51 6,7.75; 52 5.5,7.75; 53 5,7.75; 54 4.5,7.75; 55 4,7.75; 56 3.5,7.75; 57 3,7.75; 58 2.5,7.75; 59 2,7.75; 60 1.5,7.75; 61 1,7.75; 62 0.5,7.75; 63 0,7.75; 64 -0.5,7.75; 65 -1,7.75; 66 -1.5,7.75; 67 -2,7.75; 68 -2.5,7.75; 69 -3,7.75; 70 -3.5,7.75; 71 -4,7.75; 72 -4.5,7.75; 73 -5,7.75; 74 -5.5,7.75; 75 -6,7.75 | smd 1.5 x 0.27: 26 7.75,-6; 27 7.75,-5.5; 28 7.75,-5; 29 7.75,-4.5; 30 7.75,-4; 31 7.75,-3.5; 32 7.75,-3; 33 7.75,-2.5; 34 7.75,-2; 35 7.75,-1.5; 36 7.75,-1; 37 7.75,-0.5; 38 7.75,0; 39 7.75,0.5; 40 7.75,1; 41 7.75,1.5; 42 7.75,2; 43 7.75,2.5; 44 7.75,3; 45 7.75,3.5; 46 7.75,4; 47 7.75,4.5; 48 7.75,5; 49 7.75,5.5; 50 7.75,6; 76 -7.75,6; 77 -7.75,5.5; 78 -7.75,5; 79 -7.75,4.5; 80 -7.75,4; 81 -7.75,3.5; 82 -7.75,3; 83 -7.75,2.5; 84 -7.75,2; 85 -7.75,1.5; 86 -7.75,1; 87 -7.75,0.5; 88 -7.75,0; 89 -7.75,-0.5; 90 -7.75,-1; 91 -7.75,-1.5; 92 -7.75,-2; 93 -7.75,-2.5; 94 -7.75,-3; 95 -7.75,-3.5; 96 -7.75,-4; 97 -7.75,-4.5; 98 -7.75,-5; 99 -7.75,-5.5; 100 -7.75,-6
FB = drill 0.8 pad 1.93: P$1 -2.5,0; P$2 2.5,0
TO-220-11 = drill 1.1 pad 1.778: 1 -8.5,-9.37; 2 -6.8,-4.29; 3 -5.1,-9.37; 4 -3.4,-4.29; 5 -1.7,-9.37; 6 0,-4.29; 7 1.7,-9.37; 8 3.4,-4.29; 9 5.1,-9.37; 10 6.8,-4.29; 11 8.5,-9.37
1X2-3.5MM = drill 1 pad 2.184: 1 1.8,0; 2 -1.7,0
MA05-1 = drill 1.016 long: 1 -5.08,0; 2 -2.54,0; 3 0,0; 4 2.54,0; 5 5.08,0
JP1 = drill 0.914 long: 1 0,-1.27; 2 0,1.27
0603-RES = smd 1.1 x 1: 1 -0.85,0; 2 0.85,0
R0603 = smd 1 x 1.1: 1 -0.85,0; 2 0.85,0
MA04-1 = drill 1.016 long: 1 -3.81,0; 2 -1.27,0; 3 1.27,0; 4 3.81,0
QFN-24-TESTING = smd 1.016 x 0.254: 1 -2.066,1.257; 2 -2.066,0.75; 3 -2.066,0.247; 4 -2.066,-0.287; 5 -2.066,-0.792; 6 -2.066,-1.297; 13 2.086,-1.297; 14 2.086,-0.792; 15 2.086,-0.287; 16 2.086,0.247; 17 2.086,0.75; 18 2.086,1.257 | smd 0.254 x 1.016: 7 -1.267,-2.122; 8 -0.762,-2.122; 9 -0.258,-2.122; 10 0.278,-2.122; 11 0.78,-2.122; 12 1.287,-2.122; 19 1.287,2.082; 20 0.78,2.082; 21 0.278,2.082; 22 -0.258,2.082; 23 -0.762,2.082; 24 -1.267,2.082 | smd 2.616 x 2.616: P$1 0.02,-0.01
PSOP-8 = smd 0.25 x 0.5: 1 -0.73,-1.37; 2 -0.23,-1.37; 3 0.27,-1.37; 4 0.77,-1.37; 5 0.77,1.38; 6 0.27,1.38; 7 -0.23,1.38; 8 -0.73,1.38

### Placement (x,y rotation side)
C1  90.17,97.79 0 top
C2  90.17,80.01 180 top
C3  20.7,84.45 90 top
C4  22.86,84.84 270 top
C5  31.75,92.08 270 top
C6  36.83,100.97 0 top
C7  26.29,112.39 90 top
C8  24.89,112.39 90 top
C9  18.29,112.39 90 top
C10  10.26,99.06 180 top
C11  30.48,36.83 0 top
C12  13.97,83.64 90 top
C13  17.73,78.97 270 top
C14  8.76,85.06 0 top
C15  13.94,75.49 270 top
C16  109.22,97.79 0 top
C17  109.22,80.01 180 top
C18  30.48,11.43 0 top
C19  90.17,72.39 0 top
C20  90.17,54.61 180 top
C21  49.53,36.83 0 top
C22  109.22,72.39 0 top
C23  109.22,54.61 180 top
C24  49.53,11.43 0 top
C25  90.17,46.99 0 top
C26  90.17,29.21 180 top
C27  90.17,39.37 180 top
C28  109.22,46.99 0 top
C29  109.22,29.21 180 top
C30  90.17,13.97 180 top
C31  90.17,21.59 0 top
C32  90.17,3.81 180 top
C33  109.22,13.97 180 top
C34  109.22,21.59 0 top
C35  109.22,3.81 180 top
C36  109.22,39.37 180 top
C37  49.53,29.21 180 top
C38  49.53,46.99 0 top
C39  109.22,64.77 180 top
C40  30.48,29.21 180 top
C41  30.48,46.99 0 top
C42  90.17,64.77 180 top
C43  49.53,3.81 180 top
C44  49.53,21.59 0 top
C45  90.17,90.17 180 top
C46  30.48,3.81 180 top
C47  30.48,21.59 0 top
C48  109.22,90.17 180 top
C49  109.22,123.19 0 top
C50  109.22,105.16 180 top
C51  109.22,115.57 180 top
C52  90.17,123.19 0 top
C53  90.17,105.41 180 top
C54  90.17,115.57 180 top
C55  63.14,117.65 270 top
CPU1  22.23,99.06 90 top
I1  32.36,111.84 180 top
IC1  76.2,88.9 90 top
IC2  95.25,88.9 90 top
IC3  76.2,63.5 90 top
IC4  95.25,63.5 90 top
IC5  76.2,38.1 90 top
IC6  95.25,38.1 90 top
IC7  76.2,12.7 90 top
IC8  95.25,12.7 90 top
IC9  63.5,38.1 270 top
IC10  44.45,38.1 270 top
IC11  63.5,12.7 270 top
IC12  44.45,12.7 270 top
IC13  95.25,114.3 90 top
IC14  76.2,114.3 90 top
J1  57.15,106.68 90 top
J2  120.65,95.25 270 top
J3  120.65,57.15 270 top
J4  120.65,69.85 270 top
J5  120.65,31.75 270 top
J6  120.65,44.45 270 top
J7  120.65,6.35 270 top
J8  120.65,19.05 270 top
J9  19.05,44.45 90 top
J10  19.05,31.75 90 top
J11  19.05,19.05 90 top
J12  57.15,76.2 90 top
J13  120.65,82.55 270 top
J14  19.05,6.35 90 top
J15  120.65,120.65 270 top
J16  120.65,107.95 270 top
J17  57.15,67.31 90 top
J18  57.15,97.79 90 top
J19  57.15,88.9 90 top
J20  57.15,58.42 90 top
JP1  55.88,119.3 90 top
JP2  61.72,123.37 90 top
R1  3.96,83.39 180 top
R2  3.94,80.87 180 top
R3  51.77,74.55 180 top
R4  51.79,77.93 180 top
R5  50.22,96.67 270 top
R6  51.08,99.34 0 top
R7  60.35,117.68 90 top
R8  59.49,114.12 0 top
R9  50.55,88.21 90 top
R10  51.38,90.98 180 top
R11  27.94,121.28 90 top
R12  27.94,117.47 270 top
R13  46.35,118.11 270 top
R14  39.37,118.11 270 top
R15  31.11,117.47 270 top
SV1  43.18,119.38 270 top
U1  11.63,79.27 90 top
U$3  64.39,12.7 90 top
U$4  64.34,38 90 top
U$5  94.41,12.7 270 top
U$6  45.34,38.13 90 top
U$7  75.41,38.1 270 top
U$8  94.44,38.1 270 top
U$9  94.39,63.5 270 top
U$10  45.44,12.75 90 top
U$11  75.39,12.7 270 top
U$12  75.36,114.3 270 top
U$13  94.39,88.9 270 top
U$14  94.56,114.27 270 top
U$15  75.36,63.5 270 top
U$16  75.39,88.9 270 top
U$17  34.29,120.02 90 top

### Tracks (layer width: path | path; a pad name or v marks a point on that pad's centre or on a via)
!MCLR  (via drill 0.38)
  Top 0.254: R8.1 58.53,114.22 JP1.1 55.83,114.17 47.5,114.17 45.21,111.89 v43.18,111.89 | CPU1.13 27.56,99.06 v26.29,100.33
  Bottom 0.254: v26.29,100.33 26.29,103.12 31.62,108.46 35.31,108.46 39.62,112.78 42.29,112.78 v43.18,111.89
+12V
  pour Top: 127,127 69.22,127 69.22,82.55 48.9,82.55 48.9,55.24 0,55.24 0,0 127,0
+12V1
  Top 0.254: R5.2 50.22,95.83 56.9,95.83 J18.2
BAT_MON_1  (via drill 0.38)
  Top 0.254: R3.2 50.93,77.22 50.95,77.24 50.95,77.93 R4.2 50.89,77.98 39.12,77.98 34.67,82.42 v33.15,82.42 | CPU1.92 24.23,76.99 v27.81,73.41
  Bottom 0.254: v27.81,73.41 27.81,77.09 v33.15,82.42
BAT_MON_2  (via drill 0.38)
  Top 0.254: R5.1 50.67,97.51 50.67,98.2 50.24,98.63 R6.1 47.33,102.23 v39.12,102.23 | CPU1.40 21.23,98.92 v23.24,96.9
  Bottom 0.254: v23.24,96.9 24.26,96.9 29.34,101.98 34.67,101.98 35.05,102.23 v39.12,102.23
BB_SCL  (via drill 0.38)
  Top 0.254: U$17.6 32.02,120.28 31.11,119.38 30.1,119.38 28.96,118.24 28.03,118.24 R12.1 27.85,118.24 v20.32,118.24 | v11.98,110.82 11.98,108.29 10.24,106.55 10.24,103.87 12.05,102.06 CPU1.57
  Bottom 0.254: v11.98,110.82 19.39,118.24 v20.32,118.24
BB_SDA
  Top 0.254: U$17.5 28.29,120.78 R11.1 20.64,120.44 13.45,113.25 13.45,108.86 10.9,106.31 10.9,104 12.34,102.55 14.47,102.55 CPU1.56
GND  (via drill 0.38, 0.6, 1.2)
  Top 0.254: CPU1.15 38.08,100.06 v38.99,100.97 C6.2 | C4.2 v22.86,82.55 21.84,82.55 21.34,83.06 C3.C | CPU1.45 18.73,108.78 v18.67,108.84 | U$17.4 37.6,120.78 40.01,123.19 SV1.1 | CPU1.65 12.12,98.06 v12.09,98.09 | C10.2 9.61,97.8 v9.6,97.79 | CPU1.75 14.47,92.05 v14.22,91.8 | U1.18 10.38,82.33 v9.58,83.13 | U1.1 10.38,76.44 v9.7,75.77 10.63,74.84 C15.2 | C12.2 10.73,84.29 v9.58,83.13 | C14.2 9.41,83.3 v9.58,83.13 | U1.9 15.65,79.02 16.36,78.31 17.72,78.31 C13.2 19.5,78.32 v19.56,78.26 | C8.2 C7.2 v26.29,114.55 | v24.89,114.55 24.89,113.11 24.84,113.06 | CPU1.31 25.73,108.49 v25.32,108.89 23.65,108.89 23.23,108.47 CPU1.36 | C55.2 63.14,115.11 v63.12,115.09 | v17.27,113.06 C9.2 | v52.63,79.05 52.63,77.93 R4.1 | v52.22,92.1 R10.1 | v51.92,100.46 51.92,99.34 R6.2
  Top 0.406: C5.2 v31.75,90.17
  Top 1.016: IC13.7 106.25,116 106.68,115.57 C51.2 | IC14.7 87.2,116 87.63,115.57 C54.2 | IC2.7 106.25,90.6 106.68,90.17 C48.2 | IC1.7 87.2,90.6 87.63,90.17 C45.2 | IC3.7 87.2,65.2 87.63,64.77 C42.2 | IC4.7 106.25,65.2 106.68,64.77 C39.2 | IC5.7 87.2,39.8 87.63,39.37 C27.2 | IC6.7 106.25,39.8 106.68,39.37 C36.2 | IC8.7 106.25,14.4 106.68,13.97 C33.2 | IC7.7 87.2,14.4 87.63,13.97 C30.2 | IC11.7 52.5,11 52.07,11.43 C24.2 | IC9.7 52.5,36.4 52.07,36.83 C21.2 | IC10.7 33.45,36.4 33.02,36.83 C11.2 | IC12.7 33.45,11 33.02,11.43 C18.2 | v45.97,3.68 45.97,5.33 v43.05,8.26
  other vias: 18.29,114.55 12.17,79.83 10.92,78.79 11,79.83 12.14,78.82
  pour Bottom: 127,127 0,127 0,0 127,0
LMD1  (via drill 0.38)
  Top 0.254: CPU1.3 32.43,94.06 34.16,92.33 v34.16,88.27 | v74.04,87.5 81.87,87.5 IC1.3
  Bottom 0.254: v34.16,88.27 42.55,88.27 46.99,83.82 70.36,83.82 v74.04,87.5
LMD2  (via drill 0.38)
  Top 0.254: CPU1.100 28.23,85.19 v43.56,69.85 | v74.17,83.82 82.55,83.82 84.2,82.17 96.27,82.17 97.79,83.69 104.51,83.69 IC2.3
  Bottom 0.254: v43.56,69.85 51.18,69.85 52.96,71.63 61.98,71.63 v74.17,83.82
LMD3  (via drill 0.38)
  Top 0.254: CPU1.97 26.73,81.48 v43.56,64.64 | v68.33,43.05 71.37,43.05 77.85,36.58 81.99,36.58 IC5.3
  Bottom 0.254: v43.56,64.64 43.56,63.75 45.97,61.34 45.97,57.66 49.53,54.1 56.52,54.1 66.04,44.58 67.18,44.58 68.33,43.43 v68.33,43.05
LMD4  (via drill 0.38)
  Top 0.254: CPU1.96 26.23,80.07 v43.43,62.87 | v67.31,43.05 67.31,41.4 75.69,33.02 81.79,33.02 83.44,31.37 95.89,31.37 97.54,33.02 104.6,33.02 IC6.3
  Bottom 0.254: v43.43,62.87 43.43,62.23 45.34,60.33 45.34,57.53 49.28,53.59 56.39,53.59 65.91,44.07 66.8,44.07 67.31,43.56 v67.31,43.05
LMD5  (via drill 0.38)
  Top 0.254: CPU1.99 27.73,84.03 v43.56,68.2 | v72.64,59.94 74.17,59.94 75.69,58.42 85.55,58.42 IC3.3
  Bottom 0.254: v43.56,68.2 45.85,68.2 50.93,63.12 69.47,63.12 v72.64,59.94
LMD6  (via drill 0.38)
  Top 0.254: CPU1.98 27.23,82.76 v43.56,66.42
  Bottom 0.254: v43.56,66.42 43.56,66.04 51.18,58.42 82.04,58.42 83.57,56.9 95.12,56.9 96.65,58.42 104.6,58.42 IC4.3
LMD7  (via drill 0.38)
  Top 0.254: CPU1.94 25.23,79.3 v43.43,61.09 | v66.17,43.05 66.17,19.05 74.04,11.18 81.99,11.18 IC7.3
  Bottom 0.254: v43.43,61.09 44.7,59.82 44.7,57.4 49.02,53.09 56.13,53.09 v66.17,43.05
LMD8  (via drill 0.38)
  Top 0.254: CPU1.93 24.73,78.14 v43.43,59.44 | v65.15,43.05 65.15,15.88 73.41,7.62 82.3,7.62 83.95,5.97 93.09,5.97 94.74,7.62 104.6,7.62 IC8.3
  Bottom 0.254: v43.43,59.44 43.43,57.91 48.77,52.58 55.63,52.58 v65.15,43.05
LMD9  (via drill 0.38)
  Top 0.254: CPU1.84 20.23,89.44 18.54,87.76 v18.54,87.5
  Bottom 0.254: v18.54,87.5 18.54,86.61 18.8,86.36 18.8,55.5 v21.34,52.96 39.12,52.96 48.9,43.18 54.11,43.18 IC9.3
LMD10  (via drill 0.38)
  Top 0.254: CPU1.83 19.73,89.7 18.54,88.52 17.4,88.52 v17.02,88.14
  Bottom 0.254: v17.02,88.14 17.02,87.38 18.29,86.11 18.29,54.74 v20.07,52.96 29.84,43.18 35.06,43.18 IC10.3
LMD11  (via drill 0.38)
  Top 0.254: CPU1.82 19.23,89.96 18.54,89.28 16,89.28 v15.62,88.9 | v18.67,52.96 18.67,52.83 17.4,51.56 12.83,51.56 10.67,49.4 10.67,29.08 12.32,27.43 v16.89,27.43
  Bottom 0.254: v15.62,88.9 15.62,88.01 17.78,85.85 17.78,53.85 v18.67,52.96 | v16.89,27.43 29.21,27.43 32.77,23.88 48.05,23.88 IC11.3
LMD12  (via drill 0.38)
  Top 0.254: CPU1.81 18.73,90.23 18.41,89.92 v14.35,89.92 | v17.27,52.96 12.57,52.96 9.53,49.91 9.53,28.19 11.81,25.91 v16.89,25.91
  Bottom 0.254: v14.35,89.92 14.35,88.52 17.27,85.6 v17.27,52.96 | v16.89,25.91 26.97,25.91 IC12.3
LMD13
  Top 0.254: IC13.3 104.6,109.22 97.16,109.22 95.5,107.57 83.44,107.57 81.79,109.22 76.58,109.22 60.33,92.96 50.04,92.96 48.44,94.56 48.37,94.49 47.5,94.49 46.48,93.47 33.66,93.47 32.57,94.56 CPU1.4
LMD14
  Top 0.254: IC14.3 82.12,112.65 78.99,112.65 59.82,93.47 50.29,93.47 48.64,95.12 47.24,95.12 46.1,93.98 33.91,93.98 32.83,95.06 CPU1.5
MPU_FSYNC  (via drill 0.38)
  Top 0.254: v7.67,99.08 8.51,100.08 9.09,100.08 14.47,100.05 CPU1.61 | v16.36,84.38 16.36,81.69 14.72,80.05 U1.11
  Bottom 0.254: v16.36,84.38 16.36,85.57 7.67,94.26 v7.67,99.08
MPU_INT  (via drill 0.38)
  Top 0.254: v15.52,83.87 15.52,81.92 14.16,80.56 U1.12 | v6.48,99.14 6.48,97.54 9.53,94.49 11.3,94.49 12.45,95.63 12.45,96.52 13.46,97.54 14.45,97.54 CPU1.66
  Bottom 0.254: v15.52,83.87 15.52,85.75 6.45,94.74 6.45,99.11 v6.48,99.14
MPU_SCL  (via drill 0.38)
  Top 0.254: U1.23 8.91,78.51 8.2,79.22 8.2,79.83 7.34,80.7 7.34,82.3 v6.25,83.39 R1.1 | v4.45,103.1 8.71,103.1 10.24,101.58 14.46,101.58 CPU1.58
  Bottom 0.254: v6.25,83.39 6.25,91.31 4.47,93.09 4.47,103.07 v4.45,103.1
MPU_SDA  (via drill 0.38)
  Top 0.254: U1.24 7.65,78.01 R2.1 v6.25,80.87 | v6.38,101.07 14.47,101.07 CPU1.59
  Bottom 0.254: v6.25,80.87 6.88,80.87 7.85,81.84 7.85,91.95 5.51,94.28 5.51,100.2 v6.38,101.07
N$1
  Top 0.254: C3.A 20.7,91.29 CPU1.85
N$2
  Top 0.406: C50.1 109.87,107.66 109.66,107.86
  Top 1.016: IC13.2 109.3,107.5 109.66,107.86 J15.1
N$3
  Top 0.406: C2.1 90.82,76.34 90.68,76.2
  Top 1.016: IC1.2 80.49,80.55 84.84,76.2 90.68,76.2 116.1,76.2 J13.1
N$4
  Top 0.406: C2.2 85.96,80.01 IC1.1
N$5
  Top 0.406: C1.1 85.96,97.79 IC1.11
N$6
  Top 0.406: C1.2 90.82,97.01 89.51,95.7 IC1.10
  Bottom 1.016: IC1.10 95.39,95.7 99.03,99.34 105.56,99.34 J13.2
N$7
  Top 0.406: C50.2 105.26,105.16 IC13.1
N$8
  Top 0.254: U1.20 8.67,80.05 8.1,80.62 C14.1
N$9
  Top 0.254: U1.10 17.66,79.55 C13.1
N$11
  Top 0.406: C17.1 109.87,82.26 109.66,82.46
  Top 1.016: IC2.2 109.3,82.1 109.66,82.46 J2.1
N$12
  Top 0.406: C17.2 105.01,80.01 IC2.1
N$13
  Top 0.406: C16.1 105.01,97.79 IC2.11
N$14
  Top 0.406: C16.2 109.87,95.86 110.03,95.7
  Top 1.016: IC2.10 110.03,95.7 119.4,95.7 J2.2
N$15
  Top 0.406: C20.1 90.82,50.96 90.96,50.83
  Top 1.016: IC3.2 80.49,54.77 84.43,50.83 90.96,50.83 116.12,50.83 J3.1
N$16
  Top 0.406: C20.2 85.96,54.61 IC3.1
N$17
  Top 0.406: C19.1 85.96,72.39 IC3.11
N$18
  Top 0.406: C19.2 90.82,71.89 89.23,70.3 IC3.10
  Bottom 1.016: IC3.10 95.72,70.3 99.52,74.09 105.41,74.09 J3.2
N$19
  Top 0.406: C23.1 109.87,57.27 109.92,57.32
  Top 1.016: IC4.2 109.3,56.7 109.92,57.32 J4.1
N$20
  Top 0.406: C23.2 105.01,54.61 IC4.1
N$21
  Top 0.406: C22.1 105.01,72.39 IC4.11
N$22
  Top 0.406: C22.2 109.87,70.42 109.75,70.3
  Top 1.016: IC4.10 109.75,70.3 119.4,70.3 J4.2
N$23
  Top 0.406: C26.1 90.82,25.41 90.78,25.38
  Top 1.016: IC5.2 80.49,30.18 85.29,25.38 90.78,25.38 116.08,25.38 J5.1
N$24
  Top 0.406: C26.2 85.96,29.21 IC5.1
N$25
  Top 0.406: C25.1 85.96,46.99 IC5.11
N$26
  Top 0.406: C25.2 90.82,46.95 88.77,44.9 IC5.10
  Bottom 1.016: IC5.10 94.91,44.9 98.75,48.74 105.36,48.74 J5.2
N$27
  Top 0.406: C29.1 109.87,31.46 109.66,31.66
  Top 1.016: IC6.2 109.3,31.3 109.66,31.66 J6.1
N$28
  Top 0.406: C29.2 105.01,29.21 IC6.1
N$29
  Top 0.406: C28.1 105.01,46.99 IC6.11
N$30
  Top 0.406: C28.2 109.87,45.06 110.03,44.9
  Top 1.016: IC6.10 110.03,44.9 119.4,44.9 J6.2
N$31
  Top 0.406: C32.1 90.82,1.15 90.86,1.12
  Top 1.016: IC7.2 80.49,5.06 84.43,1.12 90.86,1.12 117.22,1.12 J7.1
N$32
  Top 0.406: C32.2 85.96,3.81 IC7.1
N$33
  Top 0.406: C31.1 85.96,21.59 IC7.11
N$34
  Top 0.406: C31.2 90.82,21.22 89.1,19.5 IC7.10
  Bottom 1.016: IC7.10 96.11,19.5 99.8,23.19 105.51,23.19 J7.2
N$35
  Top 0.406: C35.1 109.87,5.7 109.48,6.08
  Top 1.016: IC8.2 109.3,5.9 109.48,6.08 J8.1
N$36
  Top 0.406: C35.2 105.01,3.81 IC8.1
N$37
  Top 0.406: C34.1 105.01,21.59 IC8.11
N$38
  Top 0.406: C34.2 109.87,19.84 110.21,19.5
  Top 1.016: IC8.10 110.21,19.5 119.4,19.5 J8.2
N$39
  Top 0.406: C38.1 48.88,50.16 48.62,50.42
  Top 1.016: IC9.2 59.21,46.43 55.22,50.42 48.62,50.42 23.22,50.42 J9.1
N$40
  Top 0.406: C38.2 53.74,46.99 IC9.1
N$41
  Top 0.406: C37.1 53.74,29.21 IC9.11
N$42
  Top 0.406: C37.2 48.88,30.02 50.16,31.3 IC9.10
  Bottom 1.016: IC9.10 43.14,31.3 39.47,27.64 34.16,27.64 J9.2
N$43
  Top 0.406: C41.1 29.83,45.47 30.4,44.9
  Top 1.016: IC10.2 30.4,44.9 J10.1
N$44
  Top 0.406: C41.2 34.69,46.99 IC10.1
N$45
  Top 0.406: IC10.11 31.52,29.6 C40.1
N$46
  Top 0.406: C40.2 29.83,31.06 29.59,31.3
  Top 1.016: IC10.10 29.59,31.3 20.3,31.3 J10.2
N$47
  Top 0.406: C44.1 48.88,25.09 48.67,25.3
  Top 1.016: IC11.2 59.21,20.88 54.79,25.3 48.67,25.3 23.5,25.3 J11.1
N$48
  Top 0.406: C44.2 53.74,21.59 IC11.1
N$49
  Top 0.406: C43.1 53.74,3.81 IC11.11
N$50
  Top 0.406: C43.2 48.88,4.79 49.99,5.9 IC11.10
  Bottom 1.016: IC11.10 43.06,5.9 39.32,2.16 34.24,2.16 J11.2
N$51
  Top 0.406: C47.1 29.83,19.55 30.14,19.24
  Top 1.016: IC12.2 30.4,19.5 30.14,19.24 J14.1
N$52
  Top 0.406: C47.2 34.69,21.59 IC12.1
N$53
  Top 0.406: C46.1 34.69,3.81 IC12.11
N$54
  Top 0.406: C46.2 29.83,5.76 29.97,5.9
  Top 1.016: IC12.10 29.97,5.9 20.3,5.9 J14.2
N$55
  Top 0.406: C49.1 105.01,123.19 IC13.11
N$56
  Top 0.406: C49.2 109.87,121.24 109.73,121.1
  Top 1.016: IC13.10 109.73,121.1 119.4,121.1 J15.2
N$57
  Top 0.406: C53.1 90.82,101.64 90.81,101.62
  Top 1.016: IC14.2 80.49,106.43 85.29,101.62 90.81,101.62 116.12,101.62 J16.1
N$58
  Top 0.406: C53.2 85.96,105.41 IC14.1
N$59
  Top 0.254: 85.57,122.78 IC14.11
  Top 0.406: C52.1 85.96,123.19 IC14.11
N$60
  Top 0.406: C52.2 90.82,122.69 89.23,121.1 IC14.10
  Bottom 1.016: IC14.10 95.24,121.1 99.08,124.94 105.36,124.94 J16.2
N$61
  Top 0.254: R8.2 60.34,116.81 R7.1 59.5,116.83 58.62,117.7 58.62,121.54 JP2.2 60.35,123.27
N$62
  Top 0.254: JP2.1 62.99,118.66 C55.1
N$63
  Top 0.254: R15.1 31.95,118.33 U$17.8 U$17.7
N$66
  Top 0.254: U$17.3 41.55,120.28 41.91,120.65 SV1.2 44.32,120.65 46.01,118.96 R13.1
N$67
  Top 0.254: U$17.2 37.7,119.78 38.1,119.38 38.95,119.38 R14.1 40.42,118.96 41.27,118.11 SV1.3
N$68
  Top 0.254: U$17.1 36.92,119.28 37.47,118.75 37.47,117.73 37.97,117.22 39.33,117.22 R14.2 40.09,117.26 41.78,115.57 SV1.4 44.66,115.57 R13.2
N$74  (via drill 2.8)
  other vias: 69.72,3.68
N$75  (via drill 2.8)
  other vias: 6.22,5.71
N$76  (via drill 2.8)
  other vias: 121.28,12.32
N$77  (via drill 2.8)
  other vias: 121.54,114.17
N$79  (via drill 2.8)
  other vias: 7.37,120.4
PROG_4  (via drill 0.38)
  Top 0.254: JP1.4 53.52,121.84 44.96,113.28 42.29,113.28 40.51,111.51 38.35,111.51 33.66,106.81 31.62,106.81 v29.97,108.46 | v27.18,108.97 27.18,108.58 27.74,108.03 27.74,106.82 CPU1.27
  Bottom 0.254: v29.97,108.46 29.84,108.46 28.7,109.6 27.81,109.6 v27.18,108.97
PROG_5
  Top 0.254: JP1.5 55.35,124.38 44.76,113.79 42.19,113.79 40.34,111.94 38.12,111.94 35.74,109.55 29.26,109.55 28.22,108.51 CPU1.26
TH_LMD1  (via drill 0.38)
  Top 0.254: CPU1.12 v45.71,98.56 v45.72,98.55
  Bottom 0.254: v45.72,98.55 45.72,97.28 50.04,92.96 77.6,92.96 78.49,93.85 85.42,93.85 IC1.9
TH_LMD2  (via drill 0.38)
  Top 0.254: CPU1.14 46.73,99.56 v46.74,99.57 | v73.79,94.23 81.41,94.23 83.31,92.33 95.63,92.33 97.28,93.98 104.6,93.98 IC2.9
  Bottom 0.254: v46.74,99.57 46.99,99.57 47.88,98.68 47.88,95.89 50.29,93.47 73.03,93.47 v73.79,94.23
TH_LMD3  (via drill 0.38)
  Top 0.254: CPU1.8 39.46,96.56 v40.01,96.01 | v51.44,71.63 51.44,64.52 52.83,63.12 58.55,63.12 v65.02,56.64
  Bottom 0.254: v40.01,96.01 v40.01,91.44 v40.01,86.49 40.01,80.9 49.28,71.63 v51.44,71.63 | v65.02,56.64 65.02,55.12 76.96,43.18 85.55,43.18 IC5.9
TH_LMD4  (via drill 0.38)
  Top 0.254: CPU1.9 40.86,97.06 v41.15,96.77 | IC6.9 89.43,43.2 87.76,41.53 84.33,41.53 82.68,43.18 76.96,43.18 61.59,58.55 53.09,58.55 50.29,61.34 v50.29,73.15
  Bottom 0.254: v41.15,96.77 41.15,91.82 v41.53,91.44 v41.53,86.49 41.53,81.92 v50.29,73.15
TH_LMD5  (via drill 0.38)
  Top 0.254: CPU1.10 42.14,97.56 v42.93,96.77 | v44.96,92.08 44.96,89.92 52.96,81.92 68.33,81.92 76.07,74.17 76.07,71.25 78.74,68.58 85.55,68.58 IC3.9
  Bottom 0.254: v42.93,96.77 42.93,94.11 v44.96,92.08
TH_LMD6  (via drill 0.38)
  Top 0.254: CPU1.11 43.29,98.06 v44.58,96.77 | v46.61,92.08 46.61,89.15 53.34,82.42 68.58,82.42 76.45,74.55 92.2,74.55 98.17,68.58 104.6,68.58 IC4.9
  Bottom 0.254: v44.58,96.77 44.58,94.11 v46.61,92.08
TH_LMD7  (via drill 0.38)
  Top 0.254: CPU1.6 35.63,95.56 v36.2,95 | v36.2,91.44 v36.2,86.61 | v43.43,53.21 60.45,53.21 69.34,44.32 v70.87,44.32
  Bottom 0.254: v36.2,95 v36.2,91.44 | v36.2,86.61 36.2,60.45 v43.43,53.21 | v70.87,44.32 70.87,23.62 76.58,17.91 85.46,17.91 IC7.9
TH_LMD8  (via drill 0.38)
  Top 0.254: CPU1.7 37.67,96.06 v38.48,95.25 | v37.72,91.44 v37.72,86.61 | v43.43,54.74 60.45,54.74 v69.09,46.1
  Bottom 0.254: v38.48,95.25 38.48,92.2 v37.72,91.44 | v37.72,86.61 37.72,60.45 v43.43,54.74 | v69.09,46.1 69.09,44.2 69.72,43.56 69.72,20.32 75.82,14.22 81.92,14.22 83.82,16.13 96.52,16.13 98.17,17.78 104.6,17.78 IC8.9
TH_LMD9  (via drill 0.38)
  Top 0.254: CPU1.90 23.23,93.33 v24.51,94.61 | IC9.9 46.12,33 45.59,33.53 v45.59,42.29 | v34.16,51.94 34.16,58.8 24.38,68.58 v24.38,72.39
  Bottom 0.254: v45.59,42.29 45.59,43.69 38.48,50.8 35.31,50.8 v34.16,51.94 | v24.51,94.61 25.27,93.85 25.27,72.9 24.77,72.39 v24.38,72.39
TH_LMD10  (via drill 0.38)
  Top 0.254: CPU1.89 22.73,93.97 v23.37,94.61 | IC10.9 43.03,33 43.81,33.78 v43.81,42.29 | v32,51.82 32,59.05 22.73,68.33 v22.73,72.39
  Bottom 0.254: v43.81,42.29 43.81,43.94 37.72,50.04 33.78,50.04 v32,51.82 | v23.37,94.61 24.38,93.6 24.38,74.17 22.73,72.52 v22.73,72.39
TH_LMD11  (via drill 0.38)
  Top 0.254: CPU1.88 v22.23,94.61 | v12.57,68.45 v20.19,68.45 | v21.59,76.45 v21.59,79.88
  Bottom 0.254: IC11.9 47.14,7.6 43.94,10.79 38.99,10.79 37.08,12.7 31.62,12.7 21.59,22.73 16.64,22.73 15.11,21.21 13.97,21.21 10.79,24.38 10.79,66.67 v12.57,68.45 | v20.19,68.45 20.7,68.45 21.59,69.34 v21.59,76.45 | v21.59,79.88 21.59,88.52 22.23,89.15 v22.23,94.61
TH_LMD12  (via drill 0.38)
  Top 0.254: CPU1.87 21.73,94.1 v21.21,94.61 | v12.57,70.23 v20.19,70.23 | v20.19,76.45 20.19,77.09 20.7,77.6 20.7,78.87 20.19,79.38 v20.19,79.88
  Bottom 0.254: IC12.9 32.91,7.6 21.34,19.18 14.22,19.18 9.65,24.13 9.65,67.31 v12.57,70.23 | v20.19,70.23 v20.19,76.45 | v20.19,79.88 20.19,88.01 21.72,89.53 21.72,94.11 v21.21,94.61
TH_LMD13
  Top 0.254: CPU1.21 64.58,103.06 77.34,115.82 81.79,115.82 83.57,117.6 88.65,117.6 89.66,118.62 97.03,118.62 97.79,119.38 104.6,119.38 IC13.9
TH_LMD14
  Top 0.254: CPU1.22 33.08,103.56 40.01,110.49 61.34,110.49 70.23,119.38 85.55,119.38 IC14.9
TRANS_OUT_MON  (via drill 0.38)
  Top 0.254: R10.2 50.55,90.98 R9.2 50.38,88.9 v48.64,88.9 | CPU1.42 20.23,97.76 v21.97,96.01
  Bottom 0.254: v21.97,96.01 30.48,96.01 34.8,91.69 34.8,89.79 35.69,88.9 v48.64,88.9
TRANSFORMER_IN
  Top 0.254: R9.1 50.55,87.38 57,87.38 57.15,87.22 J19.2
VCC
  Top 0.254: CPU1.30 26.23,111.68 C7.1 26.38,111.84 I1.P$2
VDD  (via drill 0.38, 1.1)
  Bottom 0.254: v11.66,83.19 11.66,85.45 v11.68,85.47 | v49.78,112.14 49.78,108.46 v49.66,108.33 | v51.05,112.14 v51.05,108.33
  Bottom 0.406: IC1.5 IC2.5 | IC3.5 IC4.5 | IC5.5 IC6.5 | IC7.5 IC8.5 | IC12.5 IC11.5 | IC10.5 IC9.5
  Bottom 1.016: J1.2 64.77,112.6 IC14.5 IC13.5 108.38,112.6 119.38,101.6 v124.46,101.6 v124.46,76.2 124.21,76.2 | IC2.5 109.65,87.2 120.65,76.2 124.21,76.2 | IC4.5 107.11,61.8 119.38,49.53 124.33,49.53 | 124.33,49.53 v124.46,49.53 124.33,49.66 124.33,76.07 124.21,76.2 | IC6.5 107.11,36.4 119.38,24.13 v124.46,24.13 | IC8.5 107.11,11 116.84,1.27 v124.46,1.27 124.59,1.4 124.59,24.13 v124.46,24.13 | IC12.5 33.86,14.4 24.13,24.13 v13.97,24.13 v13.97,49.53 | IC10.5 31.32,39.8 21.59,49.53 v13.97,49.53 | v13.97,49.53 v13.97,60.07 | 124.33,49.53 124.46,49.4 v124.46,24.13
  pour Top: 64.77,127 64.77,85.72 45.09,85.72 45.09,58.42 0,58.42 0,127

### Text on the board
tNames: BB | PIC | V3.3 | + | + | BAT2 | + | TRANS | + | BAT1 | + | BAT1 | + | BAT1